# Altium project 4GLuxLogger.PrjPcb
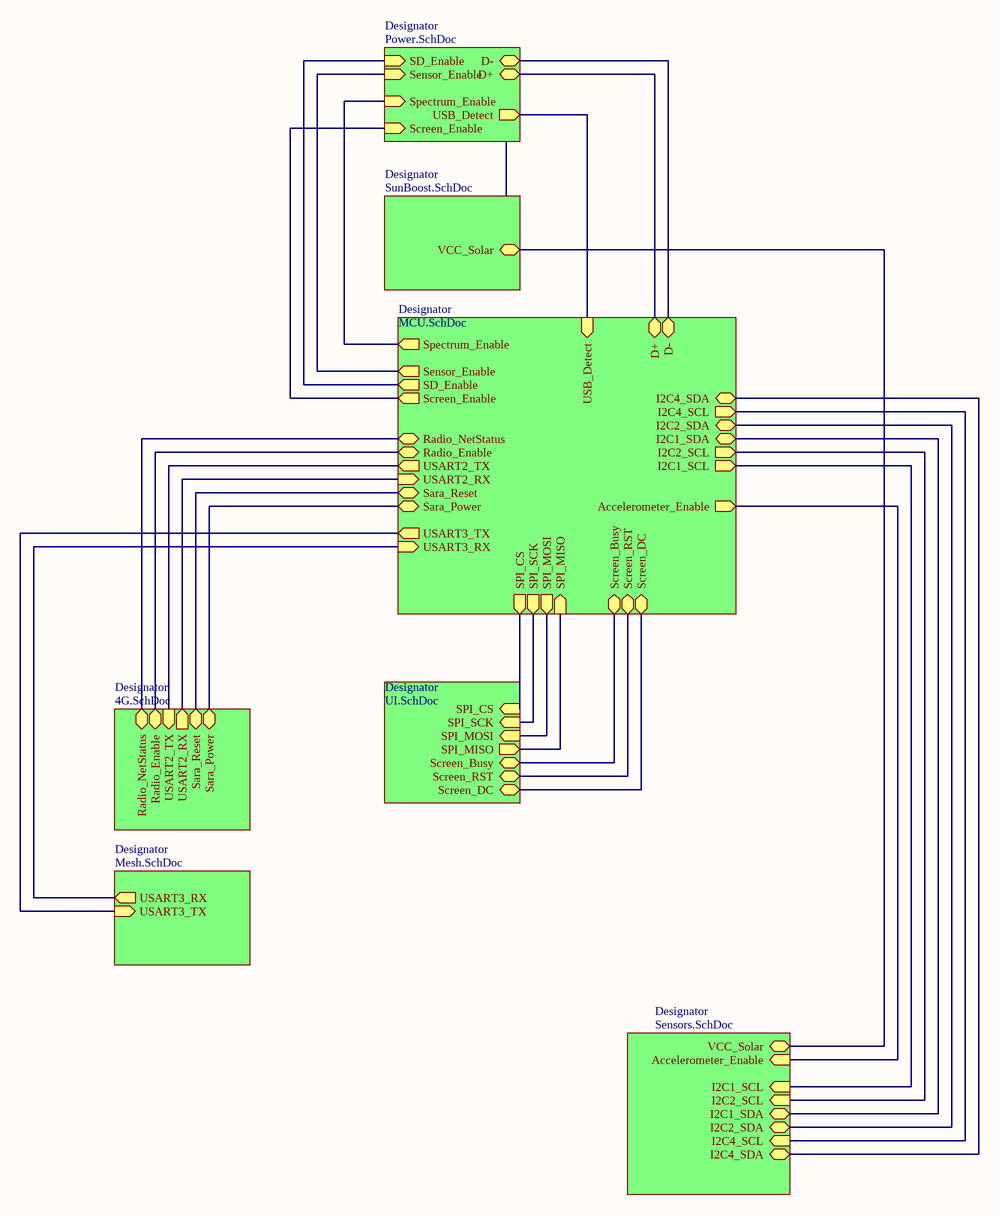
[diagram p0: OverView.SchDoc]
Project: 4GLX; Version: 1.0
7 sheets, 207 parts. Net scope: hierarchical (ports join the sheet entries above them; power ports are global).
Board files: 6C-4L-1550um.PcbDoc, 4GLL_V2.PcbDoc
Sheets:
  OverView.SchDoc
    Designator = MCU.SchDoc
    Designator = Sensors.SchDoc
    Designator = Power.SchDoc
    Designator = SunBoost.SchDoc
    Designator = 4G.SchDoc
    Designator = UI.SchDoc

## Sheet OverView.SchDoc
size A3; Organization: Altium Limited; Address1: L3, 12a Rodborough Rd; Address2: Frenchs Forest; Address3: NSW; Address4: Australia 2086

### Sub-sheets
Designator = MCU.SchDoc: Sensor_Enable (out), SD_Enable (out), SPI_CS (out), Radio_Enable (bidir), USART2_TX (out), SPI_SCK (out), USART3_RX (in), USART2_RX (in), USART3_TX (out), SPI_MISO (in), Radio_NetStatus (bidir), SPI_MOSI (out), Accelerometer_Enable (out), I2C1_SCL (out), I2C2_SCL (out), I2C1_SDA (bidir), I2C2_SDA (bidir), I2C4_SDA (bidir), I2C4_SCL (out), USB_Detect (in), Spectrum_Enable (out), Sara_Reset (bidir), Sara_Power (bidir), Screen_Enable (out), Screen_Busy (bidir), Screen_RST (bidir), Screen_DC (bidir), D- (bidir), D+ (bidir)
Designator = Sensors.SchDoc: VCC_Solar (bidir), Accelerometer_Enable (in), I2C1_SCL (in), I2C2_SCL (in), I2C1_SDA (bidir), I2C2_SDA (bidir), I2C4_SCL (in), I2C4_SDA (bidir)
Designator = Power.SchDoc: Sensor_Enable (in), SD_Enable (in), USB_Detect (out), Spectrum_Enable (in), Screen_Enable (in), D- (bidir), D+ (bidir)
Designator = SunBoost.SchDoc: VCC_Solar (bidir)
Designator = 4G.SchDoc: Radio_NetStatus (bidir), Radio_Enable (bidir), USART2_TX (in), USART2_RX (out), Sara_Reset (bidir), Sara_Power (bidir)
Designator = UI.SchDoc: SPI_CS (in), SPI_SCK (in), SPI_MOSI (in), SPI_MISO (out), Screen_Busy (bidir), Screen_DC (bidir), Screen_RST (bidir)
Designator = Mesh.SchDoc (file not in this document): USART3_TX (in), USART3_RX (out)

### Nets
Accelerometer_Enable: sheet Designator/Accelerometer_Enable, sheet Designator/Accelerometer_Enable
VCC: sheet Designator/VCC_Solar, sheet Designator/VCC_Solar
BUSY: sheet Designator/Screen_Busy, sheet Designator/Screen_Busy
CS: sheet Designator/SPI_CS, sheet Designator/SPI_CS
D/C: sheet Designator/Screen_DC, sheet Designator/Screen_DC
I2C1_SCL: sheet Designator/I2C1_SCL, sheet Designator/I2C1_SCL
I2C1_SDA: sheet Designator/I2C1_SDA, sheet Designator/I2C1_SDA
I2C2_SCL: sheet Designator/I2C2_SCL, sheet Designator/I2C2_SCL
I2C2_SDA: sheet Designator/I2C2_SDA, sheet Designator/I2C2_SDA
I2C4_SCL: sheet Designator/I2C4_SCL, sheet Designator/I2C4_SCL
I2C4_SDA: sheet Designator/I2C4_SDA, sheet Designator/I2C4_SDA
NetStatus_Out: sheet Designator/Radio_NetStatus, sheet Designator/Radio_NetStatus
Radio Enable: sheet Designator/Radio_Enable, sheet Designator/Radio_Enable
Sara_Power: sheet Designator/Sara_Power, sheet Designator/Sara_Power
Sara_Reset: sheet Designator/Sara_Reset, sheet Designator/Sara_Reset
Screen_Enable: sheet Designator/Screen_Enable, sheet Designator/Screen_Enable
Screen_RST: sheet Designator/Screen_RST, sheet Designator/Screen_RST
SD_Enable: sheet Designator/SD_Enable, sheet Designator/SD_Enable
Sensor_Enable: sheet Designator/Sensor_Enable, sheet Designator/Sensor_Enable
Spectrum_Enable: sheet Designator/Spectrum_Enable, sheet Designator/Spectrum_Enable
SPI_MISO: sheet Designator/SPI_MISO, sheet Designator/SPI_MISO
SPI_MOSI: sheet Designator/SPI_MOSI, sheet Designator/SPI_MOSI
SPI_SCK: sheet Designator/SPI_SCK, sheet Designator/SPI_SCK
USART2_RX: sheet Designator/USART2_RX, sheet Designator/USART2_RX
USART2_TX: sheet Designator/USART2_TX, sheet Designator/USART2_TX
USART3_RX: sheet Designator/USART3_RX, sheet Designator/USART3_RX
USART3_TX: sheet Designator/USART3_TX, sheet Designator/USART3_TX
USB_Detect: sheet Designator/USB_Detect, sheet Designator/USB_Detect
NetR22_1: sheet Designator/D-, sheet Designator/D-
NetR23_1: sheet Designator/D+, sheet Designator/D+

### Notes on the sheet
- Title
- Size:
- Date:
- A3
- Number:
- Time:
- Revision:
- Sheet
- of
- File:

## Sheet MCU.SchDoc
size A3; Organization: Altium Limited; Address1: L3, 12a Rodborough Rd; Address2: Frenchs Forest; Address3: NSW; Address4: Australia 2086
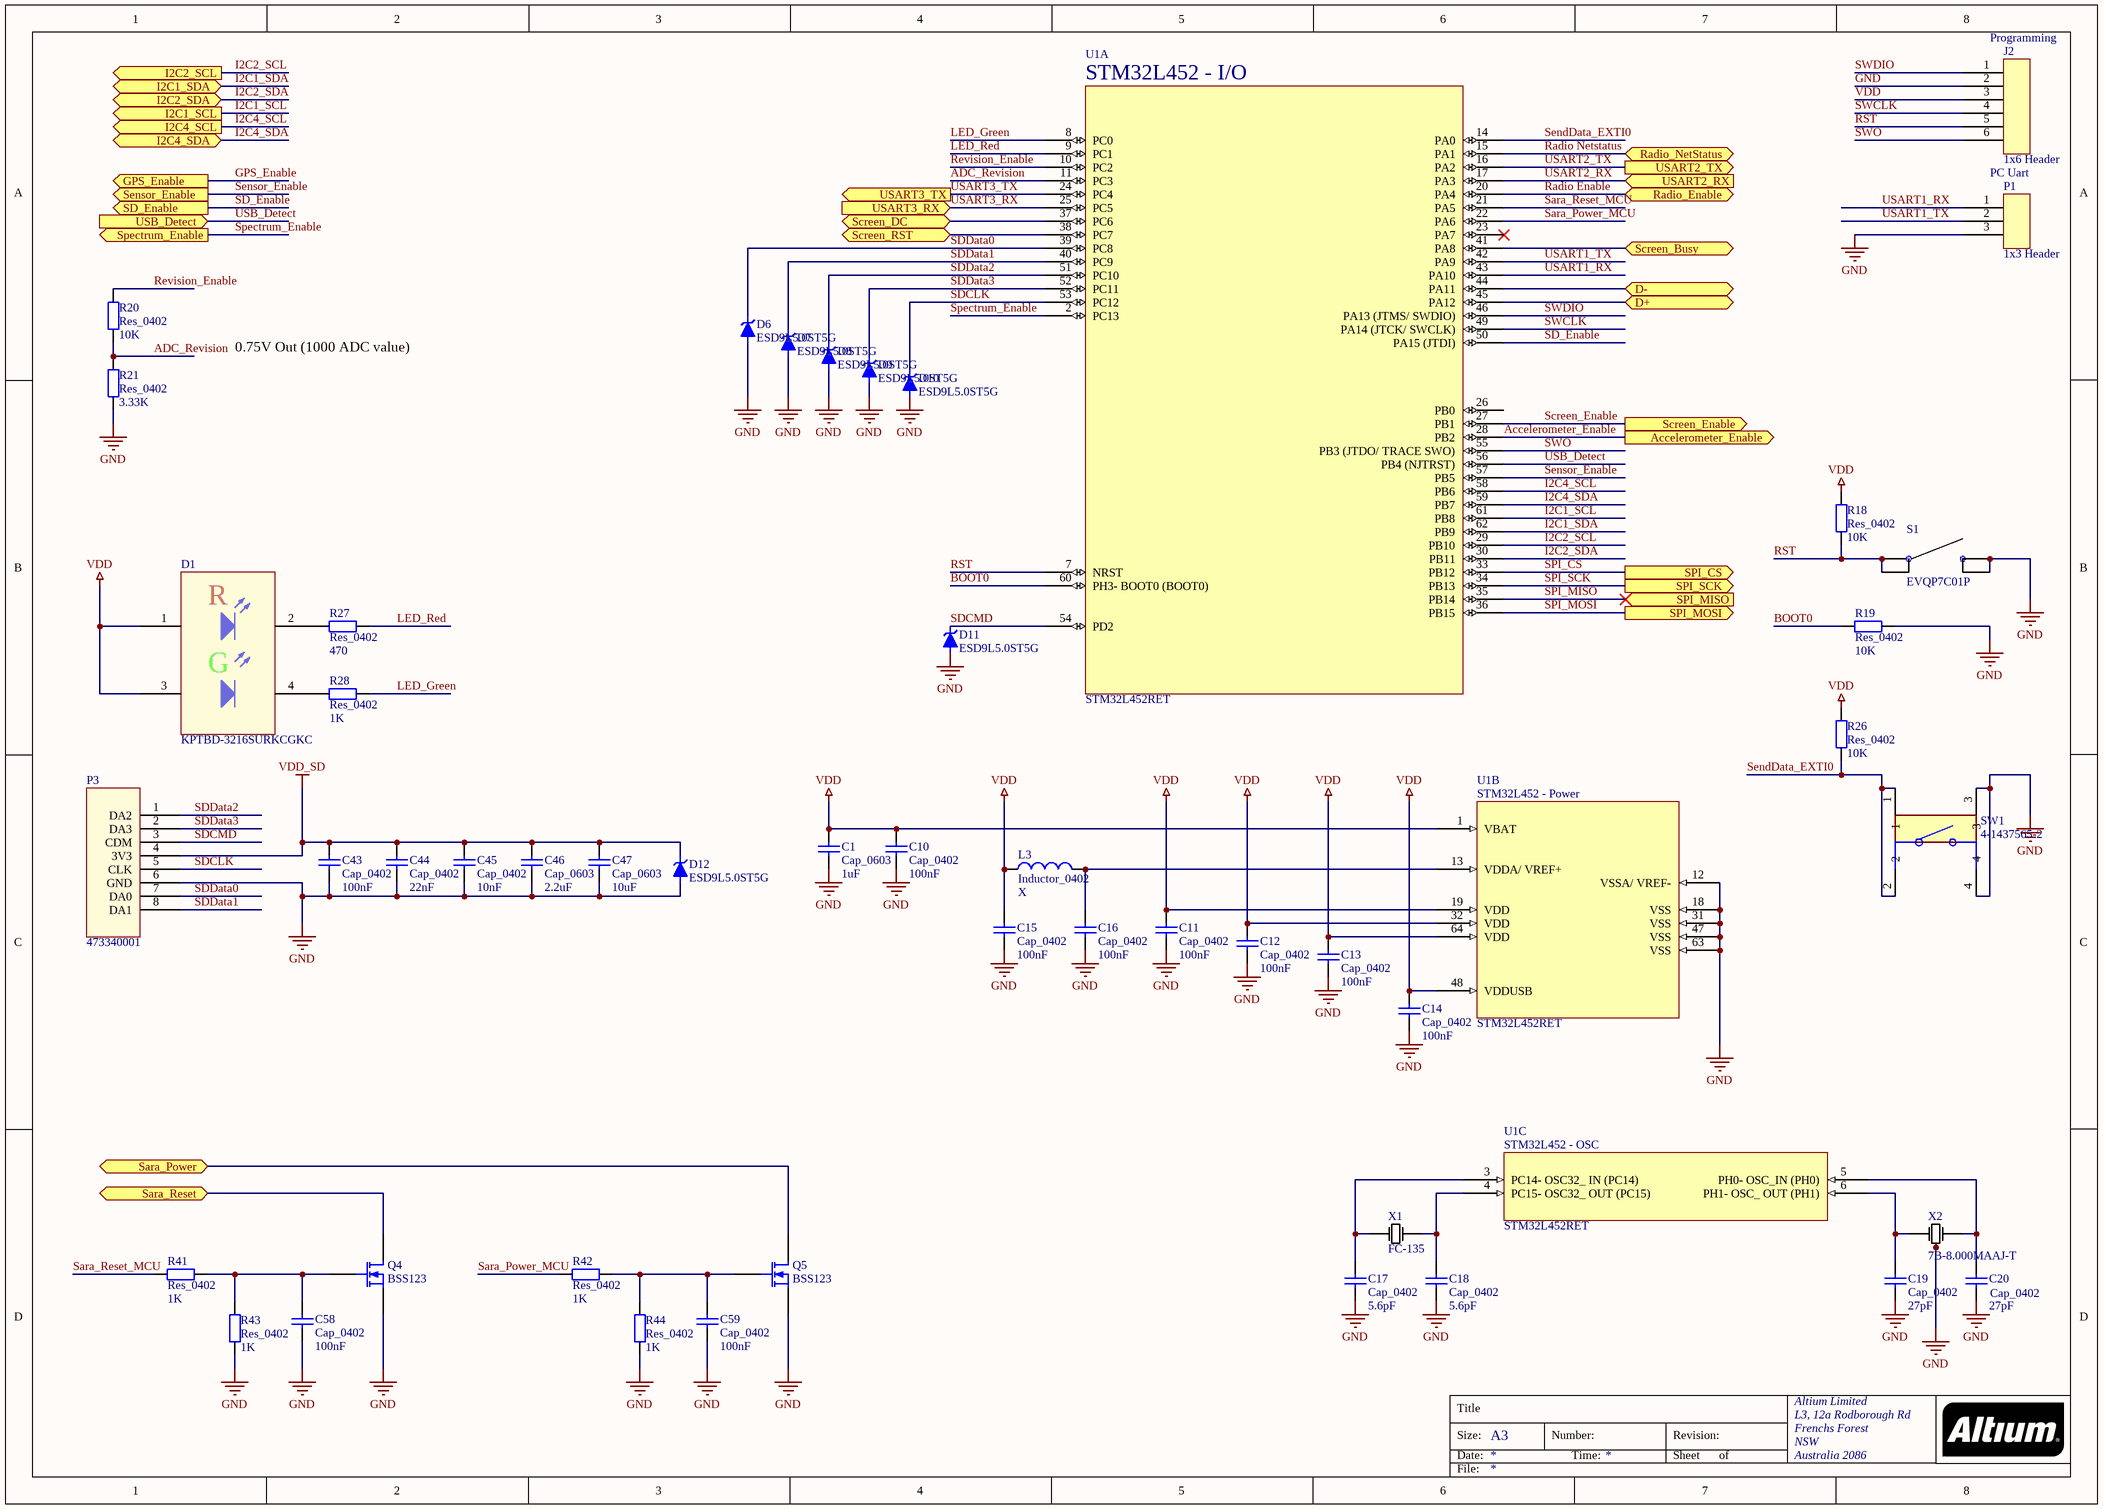
[diagram p1: MCU.SchDoc]

### Parts
(Parts that share a designator on the sheet are numbered #1, #2 ... from top to bottom, then left to right.)
C1  Cap_0603  value 1uF  [0603]
C10  Cap_0402  value 100nF  [0402]
C11  Cap_0402  value 100nF  [0402]
C12  Cap_0402  value 100nF  [0402]
C13  Cap_0402  value 100nF  [0402]
C14  Cap_0402  value 100nF  [0402]
C15  Cap_0402  value 100nF  [0402]
C16  Cap_0402  value 100nF  [0402]
C17  Cap_0402  value 5.6pF  [0402]
C18  Cap_0402  value 5.6pF  [0402]
C19  Cap_0402  value 27pF  [0402]
C20  Cap_0402  value 27pF  [0402]
C43  Cap_0402  value 100nF  [0402]
C44  Cap_0402  value 22nF  [0402]
C45  Cap_0402  value 10nF  [0402]
C46  Cap_0603  value 2.2uF  [0603]
C47  Cap_0603  value 10uF  [0603]
C58  Cap_0402  value 100nF  [0402]
C59  Cap_0402  value 100nF  [0402]
D1  KPTBD-3216SURKCGKC  [1206_DualLED]
D6  ESD9L5.0ST5G  [SODFL100X40-2N]
D7  ESD9L5.0ST5G  [SODFL100X40-2N]
D8  ESD9L5.0ST5G  [SODFL100X40-2N]
D9  ESD9L5.0ST5G  [SODFL100X40-2N]
D10  ESD9L5.0ST5G  [SODFL100X40-2N]
D11  ESD9L5.0ST5G  [SODFL100X40-2N]
D12  ESD9L5.0ST5G  [SODFL100X40-2N]
J2  1x6 Header  [1x6 Header 1.27]
L3  Inductor_0402  value X  [0402]
P1#1  1x3 Header  [1x3 Header 1.27]
P3  473340001  [473340001]
Q4  BSS123  [SOT-23]
Q5  BSS123  [SOT-23]
R18  Res_0402  value 10K  [0402]
R19  Res_0402  value 10K  [0402]
R20  Res_0402  value 10K  [0402]
R21  Res_0402  value 3.33K  [0402]
R26  Res_0402  value 10K  [0402]
R27  Res_0402  value 470  [0402]
R28  Res_0402  value 1K  [0402]
R41  Res_0402  value 1K  [0402]
R42  Res_0402  value 1K  [0402]
R43  Res_0402  value 1K  [0402]
R44  Res_0402  value 1K  [0402]
S1  EVQP7C01P  [EVQP7C]
SW1  4-1437565-2  [SW_4-1437565-2]
U1  STM32L452RET  [LQFP64]  (parts A,B,C of 3)
X1  FC-135  [FC-135]
X2  7B-8.000MAAJ-T  [Oscillator]

### Ports
Accelerometer_Enable (out), D+ (bidir), D- (bidir), GPS_Enable (out), I2C1_SCL (out), I2C1_SDA (bidir), I2C2_SCL (out), I2C2_SDA (bidir), I2C4_SCL (out), I2C4_SDA (bidir), Radio_Enable (bidir), Radio_NetStatus (bidir), Sara_Power (bidir), Sara_Reset (bidir), Screen_Busy (bidir), Screen_DC (bidir), Screen_Enable (out), Screen_RST (bidir), SD_Enable (out), Sensor_Enable (out), Spectrum_Enable (out), SPI_CS (out), SPI_MISO (in), SPI_MOSI (out), SPI_SCK (out), USART2_RX (in), USART2_TX (out), USART3_RX (in), USART3_TX (out), USB_Detect (in)

### Nets
Accelerometer_Enable: U1.28(PB2) ; port Accelerometer_Enable
GND: C1.1 C10.1 C11.1 C12.1 C13.1 C14.1 C15.1 C16.1 C17.1 C18.1 C19.1 C20.1 C43.1 C44.1 C45.1 C46.1 C47.1 C58.1 C59.1 D6.2 D7.2 D8.2 D9.2 D10.2 D11.2 D12.2 J2.2 P1#1.3 P3.6(GND) Q4.2(S) Q5.2(S) R19.2 R21.1 R43.1 R44.1 S1.3 S1.4 SW1.3 SW1.4 U1.12(VSSA/_VREF-) U1.18(VSS) U1.31(VSS) U1.47(VSS) U1.63(VSS) X2.2 X2.4
VDD: C1.2 C10.2 C11.2 C12.2 C13.2 C14.2 C15.2 D1.1 D1.3 J2.3 L3.1 R18.2 R26.2 U1.1(VBAT) U1.19(VDD) U1.32(VDD) U1.48(VDDUSB) U1.64(VDD)
VDD_SD: C43.2 C44.2 C45.2 C46.2 C47.2 D12.1 P3.4(3V3)
ADC_Revision: R20.1 R21.2 U1.11(PC3)
BOOT0: R19.1 U1.60(PH3-_BOOT0_(BOOT0))
BUSY: U1.41(PA8) ; port Screen_Busy
D/C: U1.37(PC6) ; port Screen_DC
GPS_Enable: port GPS_Enable
I2C1_SCL: U1.61(PB8) ; port I2C1_SCL
I2C1_SDA: U1.62(PB9) ; port I2C1_SDA
I2C2_SCL: U1.29(PB10) ; port I2C2_SCL
I2C2_SDA: U1.30(PB11) ; port I2C2_SDA
I2C4_SCL: U1.58(PB6) ; port I2C4_SCL
I2C4_SDA: U1.59(PB7) ; port I2C4_SDA
LED_Green: R28.1 U1.8(PC0)
LED_Red: R27.1 U1.9(PC1)
Radio Enable: U1.20(PA4) ; port Radio_Enable
Radio Netstatus: U1.15(PA1) ; port Radio_NetStatus  [project net NetStatus_Out]
Revision_Enable: R20.2 U1.10(PC2)
RST: J2.5 R18.1 S1.1 S1.2 U1.7(NRST)
Sara_Power: Q5.3(D) ; port Sara_Power
Sara_Power_MCU: R42.1 U1.22(PA6)
Sara_Reset: Q4.3(D) ; port Sara_Reset
Sara_Reset_MCU: R41.1 U1.21(PA5)
Screen_Enable: U1.27(PB1) ; port Screen_Enable
Screen_RST: U1.38(PC7) ; port Screen_RST
SD_Enable: U1.50(PA15_(JTDI)) ; port SD_Enable
SDCLK: D10.1 P3.5(CLK) U1.53(PC12)
SDCMD: D11.1 P3.3(CDM) U1.54(PD2)
SDData0: D6.1 P3.7(DA0) U1.39(PC8)
SDData1: D7.1 P3.8(DA1) U1.40(PC9)
SDData2: D8.1 P3.1(DA2) U1.51(PC10)
SDData3: D9.1 P3.2(DA3) U1.52(PC11)
SendData_EXTI0: R26.1 SW1.1 SW1.2 U1.14(PA0)
Sensor_Enable: U1.57(PB5) ; port Sensor_Enable
Spectrum_Enable: U1.2(PC13) ; port Spectrum_Enable
SPI_CS: U1.33(PB12) ; port SPI_CS  [project net CS]
SPI_MISO: U1.35(PB14) ; port SPI_MISO
SPI_MOSI: U1.36(PB15) ; port SPI_MOSI
SPI_SCK: U1.34(PB13) ; port SPI_SCK
SWCLK: J2.4 U1.49(PA14_(JTCK/_SWCLK))
SWDIO: J2.1 U1.46(PA13_(JTMS/_SWDIO))
SWO: J2.6 U1.55(PB3_(JTDO/_TRACE_SWO))
USART1_RX: P1#1.1 U1.43(PA10)
USART1_TX: P1#1.2 U1.42(PA9)
USART2_RX: U1.17(PA3) ; port USART2_RX
USART2_TX: U1.16(PA2) ; port USART2_TX
USART3_RX: U1.25(PC5) ; port USART3_RX
USART3_TX: U1.24(PC4) ; port USART3_TX
USB_Detect: U1.56(PB4_(NJTRST)) ; port USB_Detect
NetC16_2: C16.2 L3.2 U1.13(VDDA/_VREF+)
NetC17_2: C17.2 U1.3(PC14-_OSC32__IN_(PC14)) X1.1
NetC18_2: C18.2 U1.4(PC15-_OSC32__OUT_(PC15)) X1.2
NetC19_2: C19.2 U1.6(PH1-_OSC__OUT_(PH1)) X2.1
NetC20_2: C20.2 U1.5(PH0-_OSC_IN_(PH0)) X2.3
NetC58_2: C58.2 Q4.1(G) R41.2 R43.2
NetC59_2: C59.2 Q5.1(G) R42.2 R44.2
NetD1_2: D1.2 R27.2
NetD1_4: D1.4 R28.2
NetR22_1: U1.44(PA11) ; port D-
NetR23_1: U1.45(PA12) ; port D+

Not connected (* = marked no-connect by the designer): U1 23(PA7)* 26(PB0)

### Notes on the sheet
- (near J2) Programming
- PC Uart
- 0.75V Out (1000 ADC value)
- Title
- Size:
- Date:
- A3
- Number:
- Time:
- Revision:
- Sheet
- of
- File:
- (in symbol KPTBD-3216SURKCGKC) R; G
- (in symbol STM32L452RET, part A) STM32L452 - I/O
- (in symbol STM32L452RET, part B) STM32L452 - Power
- (in symbol STM32L452RET, part C) STM32L452 - OSC

### Library data of the parts
C1 C46 C47 = Cap_0603: Capacitor; Published: 8-Jun-2000; LatestRevisionDate: 17-Jul-2002; LatestRevisionNote: Re-released for DXP Platform.; PackageReference: RAD-0.3; Publisher: Altium Limited; PackageDescription: Radial Cap, Thru-Hole; 2 Leads; 0.3 in Pin Spacing
C10-C20 C43-C45 C58 C59 = Cap_0402: Capacitor; Published: 8-Jun-2000; LatestRevisionDate: 17-Jul-2002; LatestRevisionNote: Re-released for DXP Platform.; PackageReference: RAD-0.3; Publisher: Altium Limited; PackageDescription: Radial Cap, Thru-Hole; 2 Leads; 0.3 in Pin Spacing
D1 = KPTBD-3216SURKCGKC: Dual Led Red/Green; Published: 8-Jun-2000; LatestRevisionDate: 08-Jul-2005; LatestRevisionNote: Mech Layer 1 removed.; PackageReference: LED-0; Publisher: Altium Limited; PackageDescription: LED; 2 Leads
D6-D12 = ESD9L5-0ST5G: TVS_ESD9L5-0ST5G
L3 = Inductor_0402: Inductor
P3 = SD Micro Card Holder
Q4 Q5 = BSS123: N-Channel MOSFET; Published: 8-Jun-2000; LatestRevisionDate: 17-Jul-2002; LatestRevisionNote: Re-released for DXP Platform.; PackageVersion: 1995/1996; PackageReference: E3; Publisher: Altium Limited; PackageDescription: TO, Flat Index; 3 In-Line, Axial Leads; Body Dia. 4.6mm; Lead Dia. 0.5 mm (max)
R18-R21 R26-R28 R41-R44 = Res_0402: Resistor; Published: 8-Jun-2000; LatestRevisionDate: 17-Jul-2002; LatestRevisionNote: Re-released for DXP Platform.; PackageReference: AXIAL-0.4; Publisher: Altium Limited; PackageDescription: Axial Device, Thru-Hole; 2 Leads; 0.4 in Pin Spacing
S1 = EVQP7C01P: EVQP7C01P Switch
SW1 = 4-1437565-2: Switch Tactile OFF (ON) SPST Round Button Gull Wing 0.05A 12VDC 1.57N SMD T/R; MF: {'manufacturer': u'TE Connectivity'}; Price: None; Value: *; Availability: Unavailable; Package: None; MP: 4-1437565-2
U1 = STM32L452RET: MCU; Man. Part no: STM32L452RET6; Digikey no: 497-17219-ND; Farnell no: 2758810
X1 = Oscillator 32.768KHz
X2 = Oscillator 8MHz

## Sheet Sensors.SchDoc
size A3; Organization: Altium Limited; Address1: L3, 12a Rodborough Rd; Address2: Frenchs Forest; Address3: NSW; Address4: Australia 2086
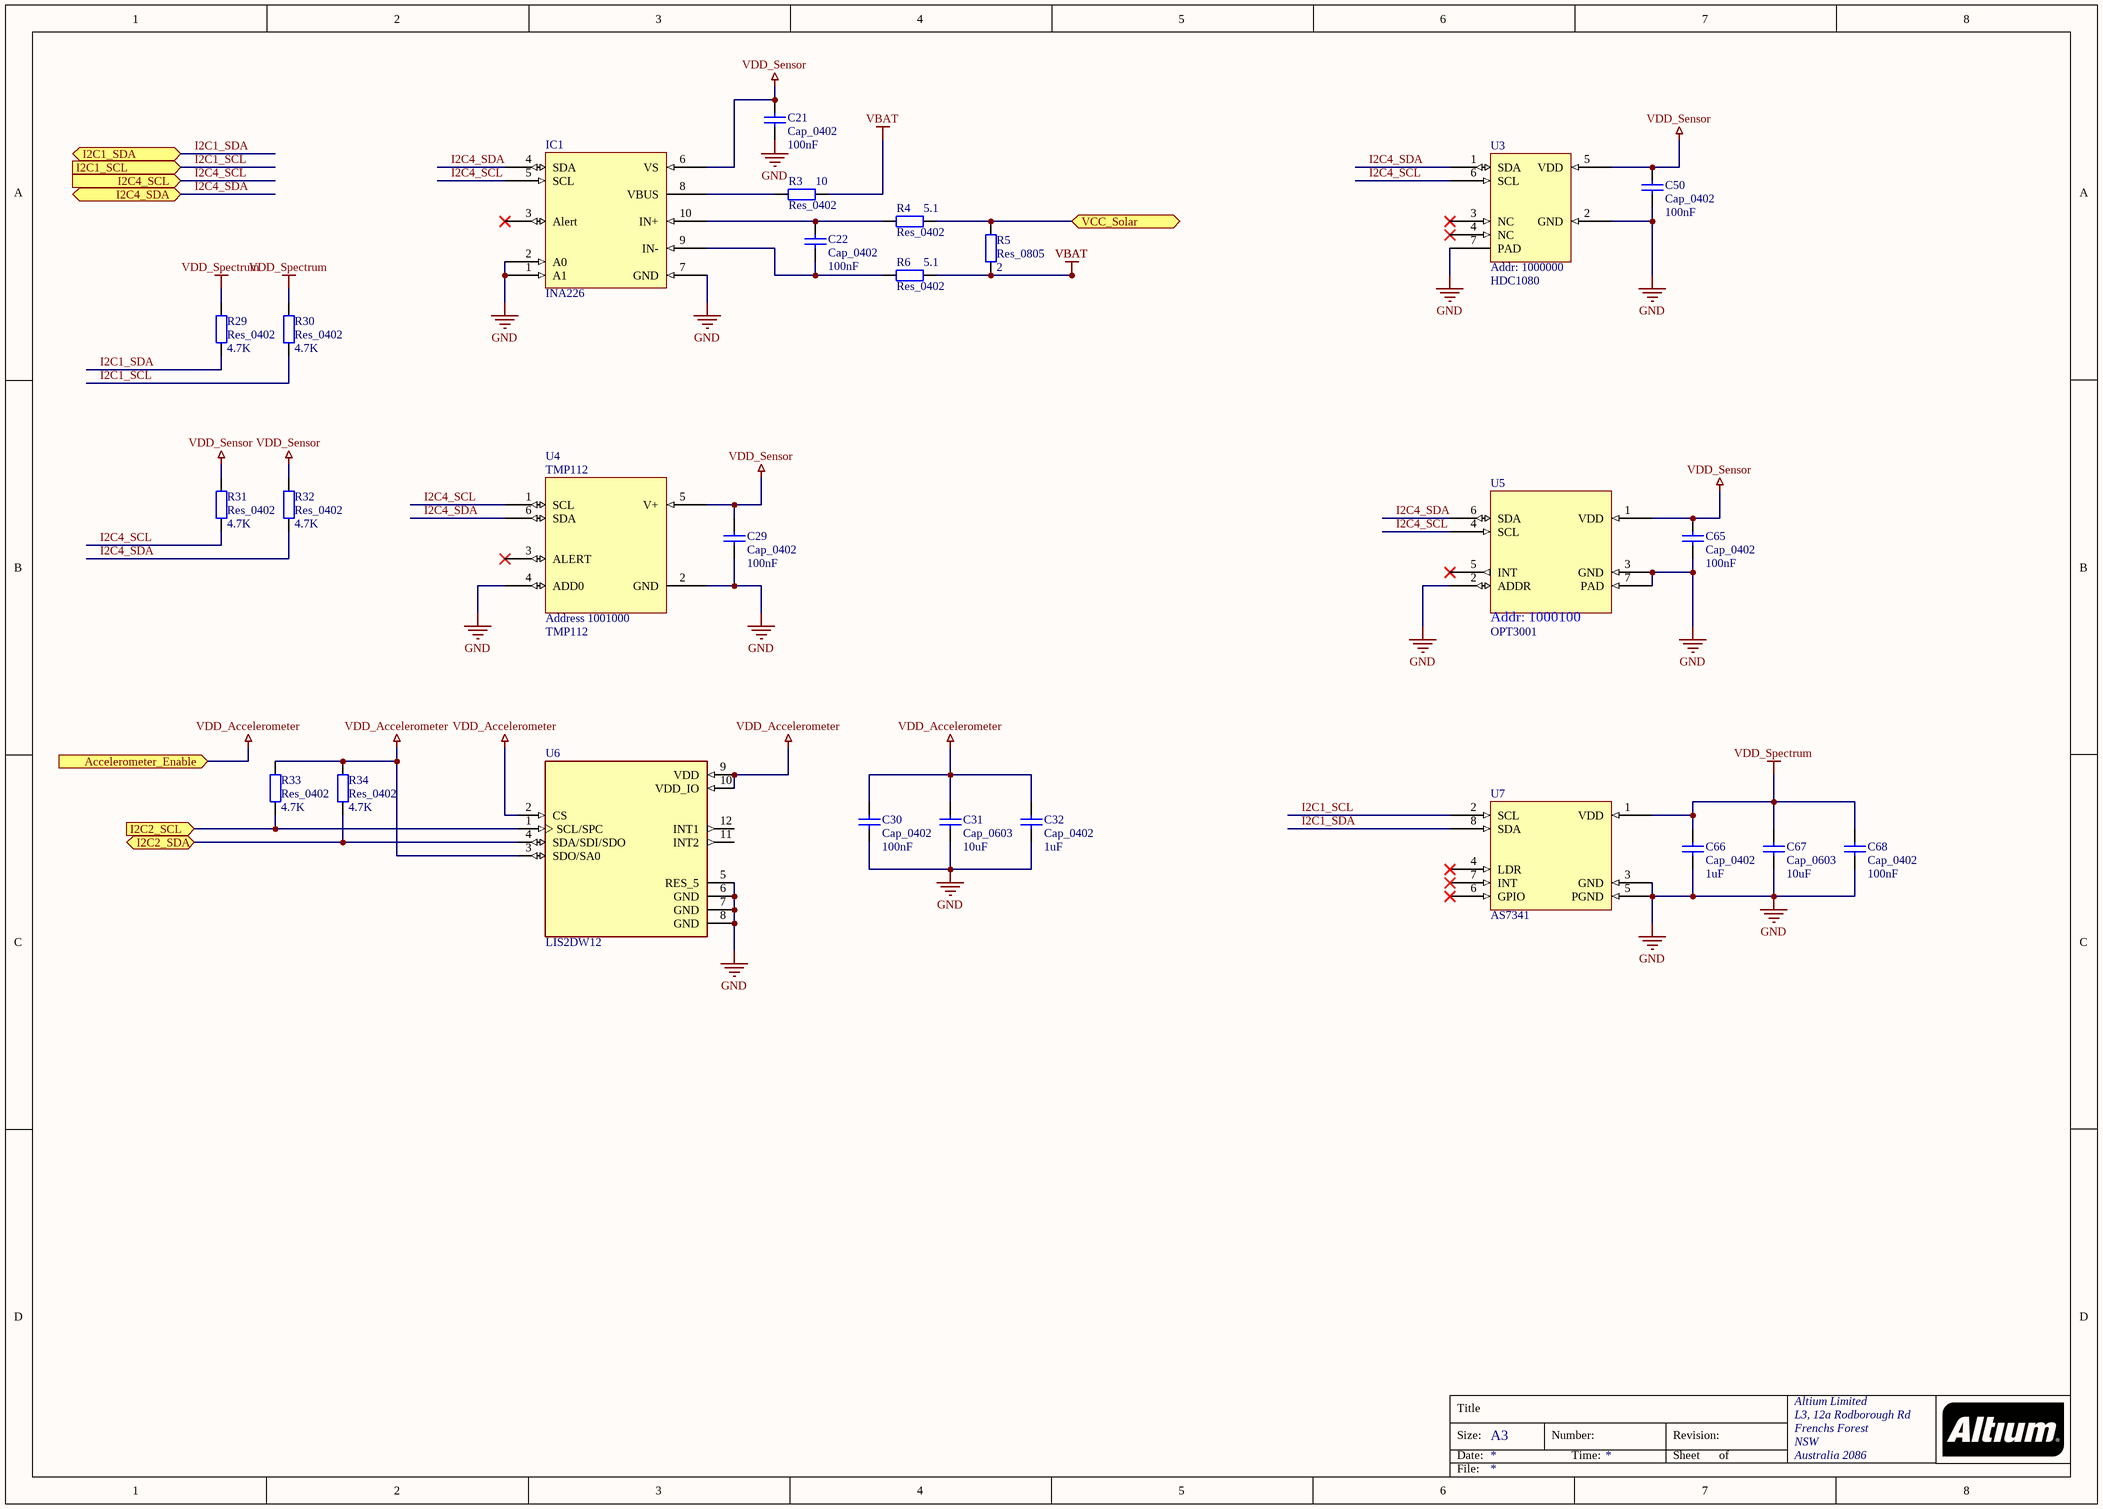
[diagram p2: Sensors.SchDoc]

### Parts
C21  Cap_0402  value 100nF  [0402]
C22  Cap_0402  value 100nF  [0402]
C29  Cap_0402  value 100nF  [0402]
C30  Cap_0402  value 100nF  [0402]
C31  Cap_0603  value 10uF  [0603]
C32  Cap_0402  value 1uF  [0402]
C50  Cap_0402  value 100nF  [0402]
C65  Cap_0402  value 100nF  [0402]
C66  Cap_0402  value 1uF  [0402]
C67  Cap_0603  value 10uF  [0603]
C68  Cap_0402  value 100nF  [0402]
IC1  INA226  [VSSOP-10]
R3  Res_0402  value 10  [0402]
R4  Res_0402  value 5.1  [0402]
R5  Res_0805  value 2  [0805]
R6  Res_0402  value 5.1  [0402]
R29  Res_0402  value 4.7K  [0402]
R30  Res_0402  value 4.7K  [0402]
R31  Res_0402  value 4.7K  [0402]
R32  Res_0402  value 4.7K  [0402]
R33  Res_0402  value 4.7K  [0402]
R34  Res_0402  value 4.7K  [0402]
U3  HDC1080  [PSON95P300X80_HS]
U4  TMP112  [SOT563 (6)]
U5  OPT3001  [USON-6]
U6  LIS2DW12  [LGA-12]
U7  AS7341  [OLGA-8]

### Ports
Accelerometer_Enable (in), I2C1_SCL (in), I2C1_SDA (bidir), I2C2_SCL (in), I2C2_SDA (bidir), I2C4_SCL (in), I2C4_SDA (bidir), VCC_Solar (bidir)

### Nets
GND: C21.1 C29.1 C30.1 C31.1 C32.1 C50.1 C65.1 C66.1 C67.1 C68.1 IC1.1(A1) IC1.2(A0) IC1.7(GND) U3.2(GND) U3.7(PAD) U4.2(GND) U4.4(ADD0) U5.2(ADDR) U5.3(GND) U5.7(PAD) U6.5(RES_5) U6.6(GND) U6.7(GND) U6.8(GND) U7.3(GND) U7.5(PGND)
VBAT: R3.2 R5.1 R6.2
VCC: R4.2 R5.2 ; port VCC_Solar
VDD_Accelerometer: C30.2 C31.2 C32.2 R33.2 R34.2 U6.2(CS) U6.3(SDO/SA0) U6.9(VDD) U6.10(VDD_IO) ; port Accelerometer_Enable  [project net Accelerometer_Enable]
VDD_Sensor: C21.2 C29.2 C50.2 C65.2 IC1.6(VS) R31.2 R32.2 U3.5(VDD) U4.5(V+) U5.1(VDD)
VDD_Spectrum: C66.2 C67.2 C68.2 R29.2 R30.2 U7.1(VDD)
I2C1_SCL: R30.1 U7.2(SCL) ; port I2C1_SCL
I2C1_SDA: R29.1 U7.8(SDA) ; port I2C1_SDA
I2C2_SCL: R33.1 U6.1(SCL/SPC) ; port I2C2_SCL
I2C2_SDA: R34.1 U6.4(SDA/SDI/SDO) ; port I2C2_SDA
I2C4_SCL: IC1.5(SCL) R31.1 U3.6(SCL) U4.1(SCL) U5.4(SCL) ; port I2C4_SCL
I2C4_SDA: IC1.4(SDA) R32.1 U3.1(SDA) U4.6(SDA) U5.6(SDA) ; port I2C4_SDA
NetC22_1: C22.1 IC1.9(IN-) R6.1
NetC22_2: C22.2 IC1.10(IN+) R4.1
NetIC1_8: IC1.8(VBUS) R3.1

Not connected (* = marked no-connect by the designer): IC1 3(Alert)*; U3 3(NC)* 4(NC)*; U4 3(ALERT)*; U5 5(INT)*; U6 11(INT2) 12(INT1); U7 4(LDR)* 6(GPIO)* 7(INT)*

### Notes on the sheet
- Title
- Size:
- Date:
- A3
- Number:
- Time:
- Revision:
- Sheet
- of
- File:
- (in symbol HDC1080) Addr: 1000000
- (in symbol OPT3001) Addr: 1000100
- (in symbol TMP112) Address 1001000

### Library data of the parts
C21 C22 C29 C30 C32 C50 C65 C66 C68 = Cap_0402: Capacitor; Published: 8-Jun-2000; LatestRevisionDate: 17-Jul-2002; LatestRevisionNote: Re-released for DXP Platform.; PackageReference: RAD-0.3; Publisher: Altium Limited; PackageDescription: Radial Cap, Thru-Hole; 2 Leads; 0.3 in Pin Spacing
C31 C67 = Cap_0603: Capacitor; Published: 8-Jun-2000; LatestRevisionDate: 17-Jul-2002; LatestRevisionNote: Re-released for DXP Platform.; PackageReference: RAD-0.3; Publisher: Altium Limited; PackageDescription: Radial Cap, Thru-Hole; 2 Leads; 0.3 in Pin Spacing
IC1 = INA226: Bi-Directional Current and Power Monitor
R3 R4 R6 R29-R34 = Res_0402: Resistor; Published: 8-Jun-2000; LatestRevisionDate: 17-Jul-2002; LatestRevisionNote: Re-released for DXP Platform.; PackageReference: AXIAL-0.4; Publisher: Altium Limited; PackageDescription: Axial Device, Thru-Hole; 2 Leads; 0.4 in Pin Spacing
R5 = Res_0805: Resistor; Published: 8-Jun-2000; LatestRevisionDate: 17-Jul-2002; LatestRevisionNote: Re-released for DXP Platform.; PackageReference: AXIAL-0.4; Publisher: Altium Limited; PackageDescription: Axial Device, Thru-Hole; 2 Leads; 0.4 in Pin Spacing
U3 = HDC1080: Humidity Sensor
U4 = TMP112: Temperature measurement unit; Man. Part no.: TMP112AIDRLR; Digikey no.: 296-38578-1-ND; Farnell no.: 3009067
U5 = OPT3001: Lux sensor
U6 = LIS2DW12: Accelerometer X, Y, Z Axis Â±2g, 4g, 8g, 16g 0.5Hz ~ 672Hz 12-LGA _2x2_; MF: STMicroelectronics; MP: LIS2DH12; SnapEDA_Link: https://www.snapeda.com/parts/LIS2DH12/STMicroelectronics/view-part/480350/?ref=snap; Package: LGA-12 STMicroelectronics; Price: None; Value: *; Availability: Unavailable
U7 = AS7341: Spectrum Sensor

## Sheet Power.SchDoc
size A3; Organization: Altium Limited; Address1: L3, 12a Rodborough Rd; Address2: Frenchs Forest; Address3: NSW; Address4: Australia 2086
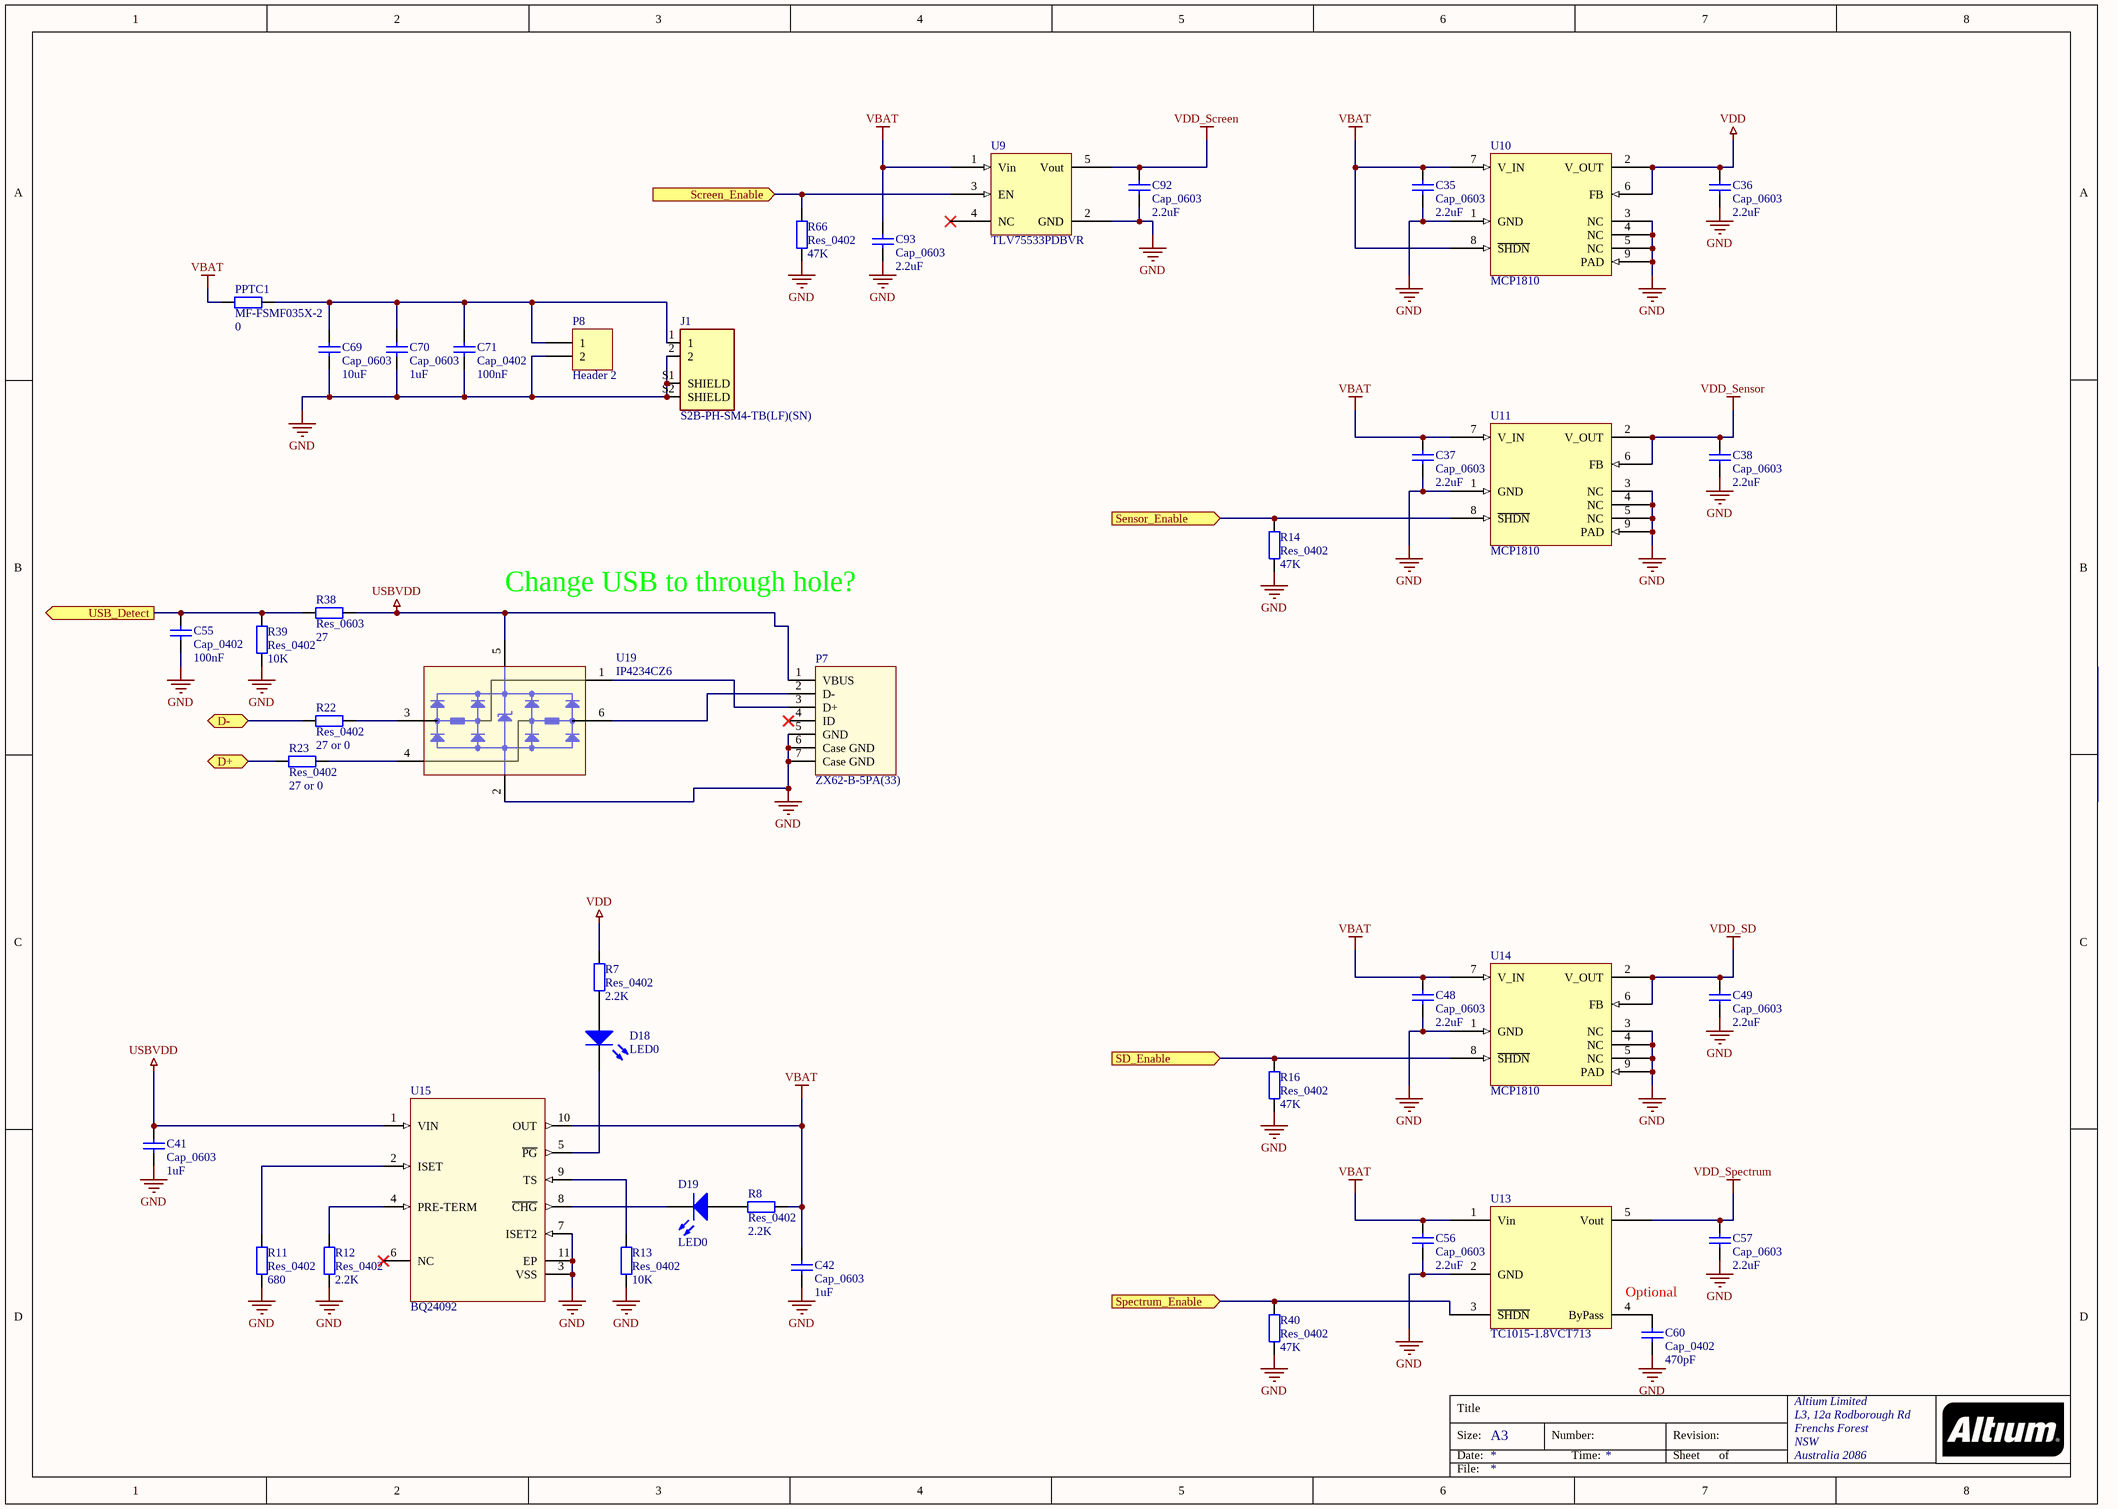
[diagram p3: Power.SchDoc]

### Parts
C35  Cap_0603  value 2.2uF  [0603]
C36  Cap_0603  value 2.2uF  [0603]
C37  Cap_0603  value 2.2uF  [0603]
C38  Cap_0603  value 2.2uF  [0603]
C41  Cap_0603  value 1uF  [0603]
C42  Cap_0603  value 1uF  [0603]
C48  Cap_0603  value 2.2uF  [0603]
C49  Cap_0603  value 2.2uF  [0603]
C55  Cap_0402  value 100nF  [0402]
C56  Cap_0603  value 2.2uF  [0603]
C57  Cap_0603  value 2.2uF  [0603]
C60  Cap_0402  value 470pF  [0402]
C69  Cap_0603  value 10uF  [0603]
C70  Cap_0603  value 1uF  [0603]
C71  Cap_0402  value 100nF  [0402]
C92  Cap_0603  value 2.2uF  [0603]
C93  Cap_0603  value 2.2uF  [0603]
D18  LED0  [0603]
D19  LED0  [0603]
J1  S2B-PH-SM4-TB(LF)(SN)  [JST_S2B-PH-SM4-TB(LF)(SN)]
P7  ZX62-B-5PA(33)  [ZX62-B-5PA(33)]
P8  Header 2  [HDR1X2]
PPTC1  MF-FSMF035X-2  value 0  [0603]
R7  Res_0402  value 2.2K  [0402]
R8  Res_0402  value 2.2K  [0402]
R11  Res_0402  value 680  [0402]
R12  Res_0402  value 2.2K  [0402]
R13  Res_0402  value 10K  [0402]
R14  Res_0402  value 47K  [0402]
R16  Res_0402  value 47K  [0402]
R22  Res_0402  value 27 or 0  [0402]
R23  Res_0402  value 27 or 0  [0402]
R38  Res_0603  value 27  [0603]
R39  Res_0402  value 10K  [0402]
R40  Res_0402  value 47K  [0402]
R66  Res_0402  value 47K  [0402]
U9  TLV75533PDBVR  [SOT-23 (5)]
U10  MCP1810  [VDFN8]
U11  MCP1810  [VDFN8]
U13  TC1015-1.8VCT713  [SOT-23 (5)]
U14  MCP1810  [VDFN8]
U15  BQ24092  [HVSSOP-10]
U19  IP4234CZ6  [TSOP95P280X110_HS-7N]

### Ports
D+ (bidir), D- (bidir), Screen_Enable (in), SD_Enable (in), Sensor_Enable (in), Spectrum_Enable (in), USB_Detect (out)

### Nets
GND: C35.1 C36.1 C37.1 C38.1 C41.1 C42.1 C48.1 C49.1 C55.1 C56.1 C57.1 C60.1 C69.1 C70.1 C71.1 C92.1 C93.1 J1.2 J1.S1(SHIELD) J1.S2(SHIELD) P7.5(GND) P7.6(Case_GND) P7.7(Case_GND) P8.2 R11.1 R12.1 R13.1 R14.2 R16.1 R39.1 R40.2 R66.2 U9.2(GND) U10.1(GND) U10.3(NC) U10.4(NC) U10.5(NC) U10.9(PAD) U11.1(GND) U11.3(NC) U11.4(NC) U11.5(NC) U11.9(PAD) U13.2(GND) U14.1(GND) U14.3(NC) U14.4(NC) U14.5(NC) U14.9(PAD) U15.3(VSS) U15.7(ISET2) U15.11(EP) U19.2(GND)
USBVDD: C41.2 P7.1(VBUS) R38.2 U15.1(VIN) U19.5(VCC)
VBAT: C35.2 C37.2 C42.2 C48.2 C56.2 C93.2 PPTC1.1 R8.1 U9.1(Vin) U10.7(V_IN) U10.8(~{SHDN}) U11.7(V_IN) U13.1(Vin) U14.7(V_IN) U15.10(OUT)
VDD: C36.2 R7.2 U10.2(V_OUT) U10.6(FB)
VDD_Screen: C92.2 U9.5(Vout)
VDD_SD: C49.2 U14.2(V_OUT) U14.6(FB)
VDD_Sensor: C38.2 U11.2(V_OUT) U11.6(FB)
VDD_Spectrum: C57.2 U13.5(Vout)
Screen_Enable: R66.1 U9.3(EN) ; port Screen_Enable
SD_Enable: R16.2 U14.8(~{SHDN}) ; port SD_Enable
Sensor_Enable: R14.1 U11.8(~{SHDN}) ; port Sensor_Enable
Spectrum_Enable: R40.1 U13.3(~{SHDN}) ; port Spectrum_Enable
USB_Detect: C55.2 R38.1 R39.2 ; port USB_Detect
NetC60_2: C60.2 U13.4(ByPass)
NetC69_2: C69.2 C70.2 C71.2 J1.1 P8.1 PPTC1.2
NetD18_1: D18.1(K) U15.5(~{PG})
NetD18_2: D18.2(A) R7.1
NetD19_1: D19.1(K) U15.8(~{CHG})
NetD19_2: D19.2(A) R8.2
NetP7_2: P7.2(D-) U19.6(CH2_B)
NetP7_3: P7.3(D+) U19.1(CH1_A)
NetR11_2: R11.2 U15.2(ISET)
NetR12_2: R12.2 U15.4(PRE-TERM)
NetR13_2: R13.2 U15.9(TS)
NetR22_1: R22.1 ; port D-
NetR22_2: R22.2 U19.3(CH1_B)
NetR23_1: R23.1 ; port D+
NetR23_2: R23.2 U19.4(CH2_A)

Not connected (* = marked no-connect by the designer): P7 4(ID)*; U9 4(NC)*; U15 6(NC)*

### Notes on the sheet
- Change USB to through hole?
- (near U13) Optional
- Title
- Size:
- Date:
- A3
- Number:
- Time:
- Revision:
- Sheet
- of
- File:

### Library data of the parts
C35-C38 C41 C42 C48 C49 C56 C57 C69 C70 C92 C93 = Cap_0603: Capacitor; Published: 8-Jun-2000; LatestRevisionDate: 17-Jul-2002; LatestRevisionNote: Re-released for DXP Platform.; PackageReference: RAD-0.3; Publisher: Altium Limited; PackageDescription: Radial Cap, Thru-Hole; 2 Leads; 0.3 in Pin Spacing
C55 C60 C71 = Cap_0402: Capacitor; Published: 8-Jun-2000; LatestRevisionDate: 17-Jul-2002; LatestRevisionNote: Re-released for DXP Platform.; PackageReference: RAD-0.3; Publisher: Altium Limited; PackageDescription: Radial Cap, Thru-Hole; 2 Leads; 0.3 in Pin Spacing
D18 D19 = LED0: Typical INFRARED GaAs LED; Published: 8-Jun-2000; LatestRevisionDate: 08-Jul-2005; LatestRevisionNote: Mech Layer 1 removed.; PackageReference: LED-0; Publisher: Altium Limited; PackageDescription: LED; 2 Leads
J1 = S2B-PH-SM4-TB(LF)(SN): PH Series 2 Position 2 mm Pitch Surface Mount Side Entry Shrouded Header; MF: {'manufacturer': u'JST Sales'}; MP: S2B-PH-SM4-TB(LF)(SN); Availability: Unavailable; Package: None; Price: None; Value: *
P7 = ZX62-B-5PA(33): USB Connector
P8 = Header 2: Header, 2-Pin; LatestRevisionDate: 17-Jul-2002; LatestRevisionNote: Re-released for DXP Platform.; Publisher: Altium Limited
PPTC1 = MF-FSMF035X-2: PPTC_0603; Published: 8-Jun-2000; LatestRevisionDate: 17-Jul-2002; LatestRevisionNote: Re-released for DXP Platform.; PackageReference: AXIAL-0.4; Publisher: Altium Limited; PackageDescription: Axial Device, Thru-Hole; 2 Leads; 0.4 in Pin Spacing
R7 R8 R11-R14 R16 R22 R23 R39 R40 R66 = Res_0402: Resistor; Published: 8-Jun-2000; LatestRevisionDate: 17-Jul-2002; LatestRevisionNote: Re-released for DXP Platform.; PackageReference: AXIAL-0.4; Publisher: Altium Limited; PackageDescription: Axial Device, Thru-Hole; 2 Leads; 0.4 in Pin Spacing
R38 = Res_0603: Resistor; Published: 8-Jun-2000; LatestRevisionDate: 17-Jul-2002; LatestRevisionNote: Re-released for DXP Platform.; PackageReference: AXIAL-0.4; Publisher: Altium Limited; PackageDescription: Axial Device, Thru-Hole; 2 Leads; 0.4 in Pin Spacing
U9 = TLV75533PDBVR: 3.3V regulator
U10 U11 U14 = MCP1810: 3V Regulator, 150 mA
U13 = TC1015-1.8VCT713: 1.8V Regulator
U15 = BQ24092: Battery Charger
U19 = IP4234CZ6: USB Line Protection

## Sheet SunBoost.SchDoc
size A3; Organization: Altium Limited; Address1: L3, 12a Rodborough Rd; Address2: Frenchs Forest; Address3: NSW; Address4: Australia 2086
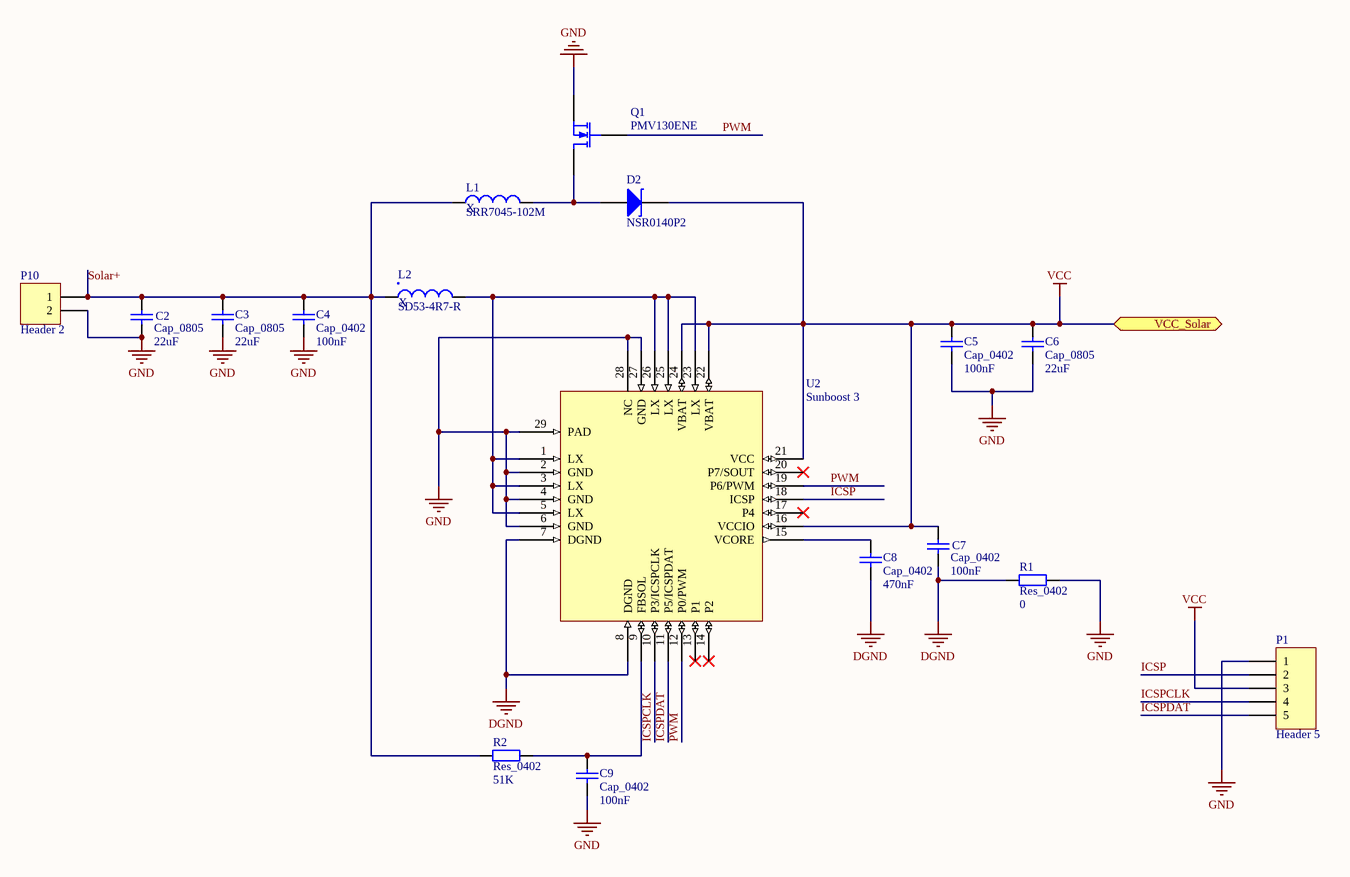
[diagram p4: SunBoost.SchDoc]

### Parts
(Parts that share a designator on the sheet are numbered #1, #2 ... from top to bottom, then left to right.)
C2  Cap_0805  value 22uF  [0805]
C3  Cap_0805  value 22uF  [0805]
C4  Cap_0402  value 100nF  [0402]
C5  Cap_0402  value 100nF  [0402]
C6  Cap_0805  value 22uF  [0805]
C7  Cap_0402  value 100nF  [0402]
C8  Cap_0402  value 470nF  [0402]
C9  Cap_0402  value 100nF  [0402]
D2  NSR0140P2  [SOD-923]
L1  SRR7045-102M  value X  [SRR7045-102M]
L2  SD53-4R7-R  value X  [SD53-4R7-R]
P1#2  Header 5  [HDR1X5]
P10  Header 2  [HDR1X2]
Q1  PMV130ENE  [SOT-23]
R1  Res_0402  value 0  [0402]
R2  Res_0402  value 51K  [0402]
U2  Sunboost 3  [28-QFN_0.4mm]

### Ports
VCC_Solar (bidir)

### Nets
DGND: C7.1 C8.1 R1.1 U2.7(DGND) U2.8(DGND)
GND: C2.1 C3.1 C4.1 C5.1 C6.1 C9.1 P1#2.1 P10.2 Q1.2(S) R1.2 U2.2(GND) U2.4(GND) U2.6(GND) U2.27(GND) U2.28(NC) U2.29(PAD)
VCC: C5.2 C6.2 C7.2 D2.1(K) P1#2.3 U2.16(VCCIO) U2.21(VCC) U2.22(VBAT) U2.24(VBAT) ; port VCC_Solar
ICSP: P1#2.2 U2.18(ICSP)
ICSPCLK: P1#2.4 U2.10(P3/ICSPCLK)
ICSPDAT: P1#2.5 U2.11(P5/ICSPDAT)
PWM: Q1.1(G) U2.12(P0/PWM) U2.19(P6/PWM)
Solar+: C2.2 C3.2 C4.2 L1.1 L2.1 P10.1 R2.1
NetC8_2: C8.2 U2.15(VCORE)
NetC9_2: C9.2 R2.2 U2.9(FBSOL)
NetD2_2: D2.2(A) L1.2 Q1.3(D)
NetL2_2: L2.2 U2.1(LX) U2.3(LX) U2.5(LX) U2.23(LX) U2.25(LX) U2.26(LX)

Not connected (* = marked no-connect by the designer): U2 13(P1)* 14(P2)* 17(P4)* 20(P7/SOUT)*

### Notes on the sheet
- Title
- Size:
- Date:
- A3
- Number:
- Time:
- Revision:
- Sheet
- of
- File:

### Library data of the parts
C2 C3 C6 = Cap_0805: Capacitor; Published: 8-Jun-2000; LatestRevisionDate: 17-Jul-2002; LatestRevisionNote: Re-released for DXP Platform.; PackageReference: RAD-0.3; Publisher: Altium Limited; PackageDescription: Radial Cap, Thru-Hole; 2 Leads; 0.3 in Pin Spacing
C4 C5 C7-C9 = Cap_0402: Capacitor; Published: 8-Jun-2000; LatestRevisionDate: 17-Jul-2002; LatestRevisionNote: Re-released for DXP Platform.; PackageReference: RAD-0.3; Publisher: Altium Limited; PackageDescription: Radial Cap, Thru-Hole; 2 Leads; 0.3 in Pin Spacing
D2 = NSR0140P2: Typical INFRARED GaAs LED; Published: 8-Jun-2000; LatestRevisionDate: 08-Jul-2005; LatestRevisionNote: Mech Layer 1 removed.; PackageReference: LED-0; Publisher: Altium Limited; PackageDescription: LED; 2 Leads
L1 = SRR7045-102M: Inductor
L2 = SD53-4R7-R: Inductor
P1#2 = Header 5: Header, 5-Pin; LatestRevisionDate: 17-Jul-2002; LatestRevisionNote: Re-released for DXP Platform.; Publisher: Altium Limited
P10 = Header 2: Header, 2-Pin; LatestRevisionDate: 17-Jul-2002; LatestRevisionNote: Re-released for DXP Platform.; Publisher: Altium Limited
Q1 = PMV130ENE: N-Channel MOSFET; Published: 8-Jun-2000; LatestRevisionDate: 17-Jul-2002; LatestRevisionNote: Re-released for DXP Platform.; PackageVersion: 1995/1996; PackageReference: E3; Publisher: Altium Limited; PackageDescription: TO, Flat Index; 3 In-Line, Axial Leads; Body Dia. 4.6mm; Lead Dia. 0.5 mm (max)
R1 R2 = Res_0402: Resistor; Published: 8-Jun-2000; LatestRevisionDate: 17-Jul-2002; LatestRevisionNote: Re-released for DXP Platform.; PackageReference: AXIAL-0.4; Publisher: Altium Limited; PackageDescription: Axial Device, Thru-Hole; 2 Leads; 0.4 in Pin Spacing
U2 = Sunboost 3: Initvation Sunboost 3

## Sheet 4G.SchDoc
size A3; Organization: Altium Limited; Address1: L3, 12a Rodborough Rd; Address2: Frenchs Forest; Address3: NSW; Address4: Australia 2086
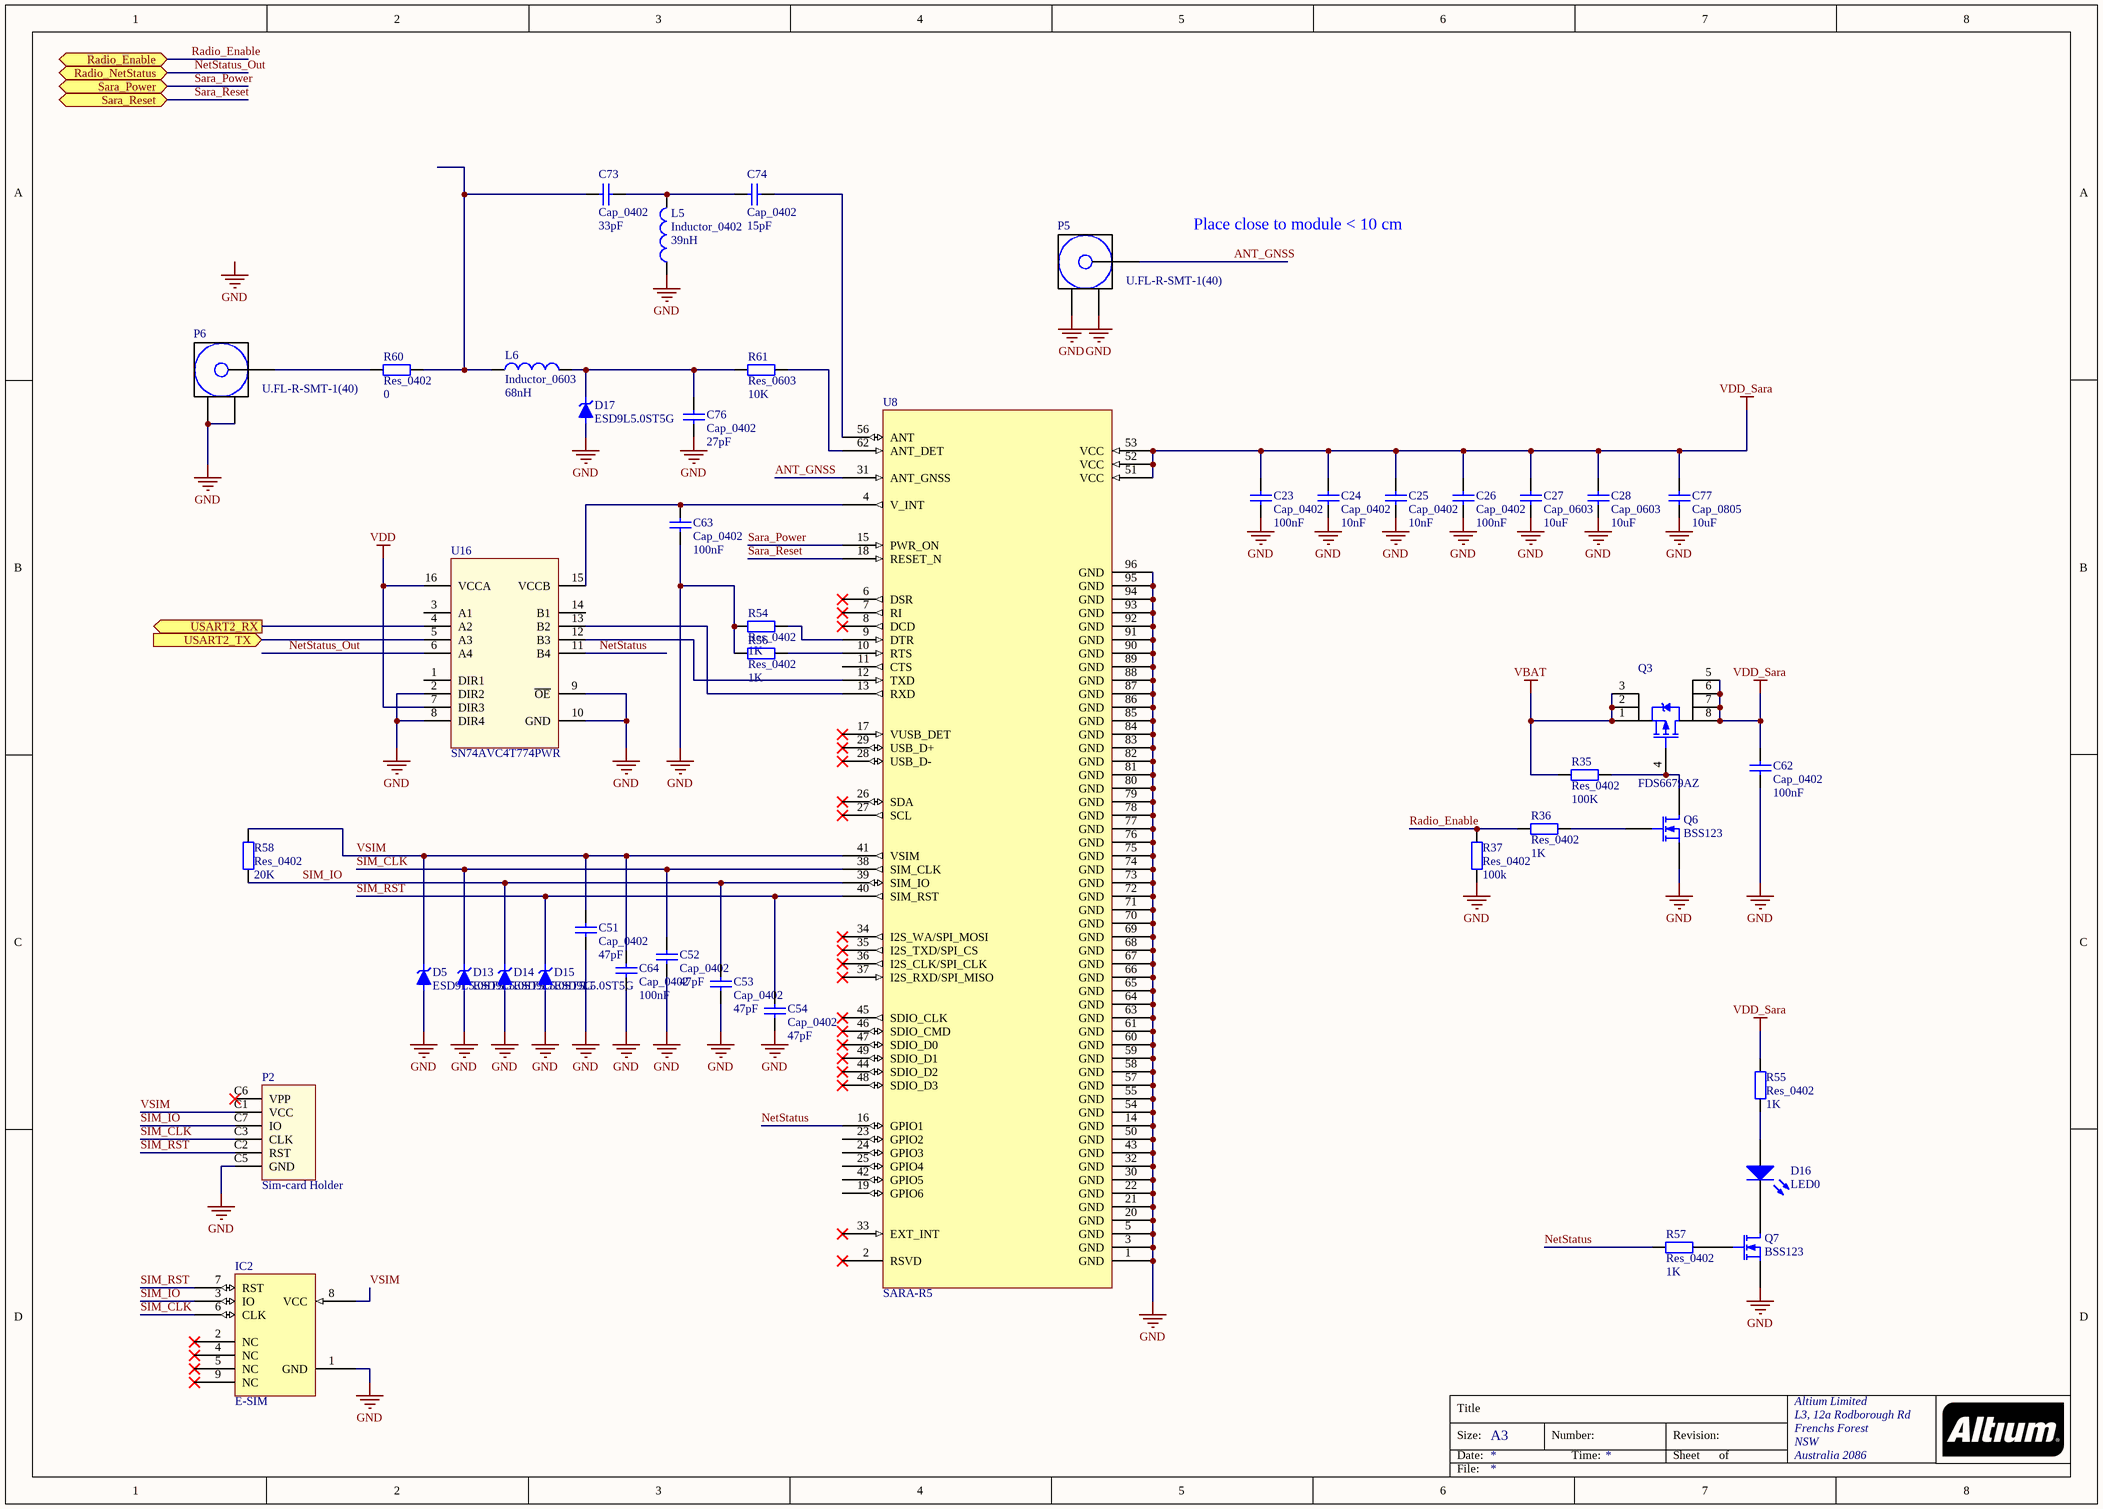
[diagram p5: 4G.SchDoc]

### Parts
C23  Cap_0402  value 100nF  [0402]
C24  Cap_0402  value 10nF  [0402]
C25  Cap_0402  value 10nF  [0402]
C26  Cap_0402  value 100nF  [0402]
C27  Cap_0603  value 10uF  [0603]
C28  Cap_0603  value 10uF  [0603]
C51  Cap_0402  value 47pF  [0402]
C52  Cap_0402  value 47pF  [0402]
C53  Cap_0402  value 47pF  [0402]
C54  Cap_0402  value 47pF  [0402]
C62  Cap_0402  value 100nF  [0402]
C63  Cap_0402  value 100nF  [0402]
C64  Cap_0402  value 100nF  [0402]
C73  Cap_0402  value 33pF  [0402]
C74  Cap_0402  value 15pF  [0402]
C76  Cap_0402  value 27pF  [0402]
C77  Cap_0805  value 10uF  [0805]
D5  ESD9L5.0ST5G  [SODFL100X40-2N]
D13  ESD9L5.0ST5G  [SODFL100X40-2N]
D14  ESD9L5.0ST5G  [SODFL100X40-2N]
D15  ESD9L5.0ST5G  [SODFL100X40-2N]
D16  LED0  [0603]
D17  ESD9L5.0ST5G  [SODFL100X40-2N]
IC2  E-SIM  [MFF2-ESIM]
L5  Inductor_0402  value 39nH  [0402]
L6  Inductor_0603  value 68nH  [0603]
P2  Sim-card Holder  [Sim-card Holder]
P5  U.FL-R-SMT-1(40)  [U.FL-R-SMT-1(40)]
P6  U.FL-R-SMT-1(40)  [U.FL-R-SMT-1(40)]
Q3  FDS6679AZ  [SOIC127P600X175-8N]
Q6  BSS123  [SOT-23]
Q7  BSS123  [SOT-23]
R35  Res_0402  value 100K  [0402]
R36  Res_0402  value 1K  [0402]
R37  Res_0402  value 100k  [0402]
R54  Res_0402  value 1K  [0402]
R55  Res_0402  value 1K  [0402]
R56  Res_0402  value 1K  [0402]
R57  Res_0402  value 1K  [0402]
R58  Res_0402  value 20K  [0402]
R60  Res_0402  value 0  [0402]
R61  Res_0603  value 10K  [0603]
U8  SARA-R5  [SARA-XX]
U16  SN74AVC4T774PWR  [TSOP65P640X120-16N]

### Ports
Radio_Enable (bidir), Radio_NetStatus (bidir), Sara_Power (bidir), Sara_Reset (bidir), USART2_RX (out), USART2_TX (in)

### Nets
GND: C23.1 C24.1 C25.1 C26.1 C27.1 C28.1 C51.1 C52.1 C53.1 C54.1 C62.1 C63.1 C64.1 C76.1 C77.1 D5.2 D13.2 D14.2 D15.2 D17.2 IC2.1(GND) L5.1 P2.C5(GND) P5.2 P5.3 P6.2 P6.3 Q6.2(S) Q7.2(S) R37.1 R54.1 R56.1 U8.1(GND) U8.3(GND) U8.5(GND) U8.14(GND) U8.20(GND) U8.21(GND) U8.22(GND) U8.30(GND) U8.32(GND) U8.43(GND) U8.50(GND) U8.54(GND) U8.55(GND) U8.57(GND) U8.58(GND) U8.59(GND) U8.60(GND) U8.61(GND) U8.63(GND) U8.64(GND) U8.65(GND) U8.66(GND) U8.67(GND) U8.68(GND) U8.69(GND) U8.70(GND) U8.71(GND) U8.72(GND) U8.73(GND) U8.74(GND) U8.75(GND) U8.76(GND) U8.77(GND) U8.78(GND) U8.79(GND) U8.80(GND) U8.81(GND) U8.82(GND) U8.83(GND) U8.84(GND) U8.85(GND) U8.86(GND) U8.87(GND) U8.88(GND) U8.89(GND) U8.90(GND) U8.91(GND) U8.92(GND) U8.93(GND) U8.94(GND) U8.95(GND) U8.96(GND) U16.2(DIR2) U16.8(DIR4) U16.9(~{OE}) U16.10(GND)
VBAT: Q3.1(S) Q3.2(S) Q3.3(S) R35.1
VDD: U16.7(DIR3) U16.16(VCCA)
VDD_Sara: C23.2 C24.2 C25.2 C26.2 C27.2 C28.2 C62.2 C77.2 Q3.5(D) Q3.6(D) Q3.7(D) Q3.8(D) R55.2 U8.51(VCC) U8.52(VCC) U8.53(VCC)
ANT_GNSS: P5.1 U8.31(ANT_GNSS)
NetStatus: R57.1 U8.16(GPIO1) U16.11(B4)
NetStatus_Out: U16.6(A4) ; port Radio_NetStatus
Radio_Enable: R36.1 R37.2 ; port Radio_Enable  [project net Radio Enable]
Sara_Power: U8.15(PWR_ON) ; port Sara_Power
Sara_Reset: U8.18(RESET_N) ; port Sara_Reset
SIM_CLK: C52.2 D13.1 IC2.6(CLK) P2.C3(CLK) U8.38(SIM_CLK)
SIM_IO: C53.2 D14.1 IC2.3(IO) P2.C7(IO) R58.1 U8.39(SIM_IO)
SIM_RST: C54.2 D15.1 IC2.7(RST) P2.C2(RST) U8.40(SIM_RST)
USART2_RX: U16.4(A2) ; port USART2_RX
USART2_TX: U16.5(A3) ; port USART2_TX
VSIM: C51.2 C64.2 D5.1 IC2.8(VCC) P2.C1(VCC) R58.2 U8.41(VSIM)
NetC63_2: C63.2 U8.4(V_INT) U16.15(VCCB)
NetC73_1: C73.1 C74.1 L5.2
NetC73_2: C73.2 L6.1 R60.2
NetC74_2: C74.2 U8.56(ANT)
NetC76_2: C76.2 D17.1 L6.2 R61.1
NetD16_1: D16.1(K) Q7.3(D)
NetD16_2: D16.2(A) R55.1
NetP6_1: P6.1 R60.1
NetQ3_4: Q3.4(G) Q6.3(D) R35.2
NetQ6_1: Q6.1(G) R36.2
NetQ7_1: Q7.1(G) R57.2
NetR54_2: R54.2 U8.9(DTR)
NetR56_2: R56.2 U8.10(RTS)
NetR61_2: R61.2 U8.62(ANT_DET)
NetU8_12: U8.12(TXD) U16.12(B3)
NetU8_13: U8.13(RXD) U16.13(B2)

Not connected (* = marked no-connect by the designer): IC2 2(NC)* 4(NC)* 5(NC)* 9(NC)*; P2 C6(VPP)*; U8 2(RSVD)* 6(DSR)* 7(RI)* 8(DCD)* 11(CTS) 17(VUSB_DET)* 19(GPIO6) 23(GPIO2) 24(GPIO3) 25(GPIO4) 26(SDA)* 27(SCL)* 28(USB_D-)* 29(USB_D+)* 33(EXT_INT)* 34(I2S_WA/SPI_MOSI)* 35(I2S_TXD/SPI_CS)* 36(I2S_CLK/SPI_CLK)* 37(I2S_RXD/SPI_MISO)* 42(GPIO5) 44(SDIO_D2)* 45(SDIO_CLK)* 46(SDIO_CMD)* 47(SDIO_D0)* 48(SDIO_D3)* 49(SDIO_D1)*; U16 1(DIR1) 3(A1) 14(B1)

### Notes on the sheet
- Place close to module < 10 cm
- Labels drawn without touching a wire or pin: GND
- Title
- Size:
- Date:
- A3
- Number:
- Time:
- Revision:
- Sheet
- of
- File:

### Library data of the parts
C23-C26 C51-C54 C62-C64 C73 C74 C76 = Cap_0402: Capacitor; Published: 8-Jun-2000; LatestRevisionDate: 17-Jul-2002; LatestRevisionNote: Re-released for DXP Platform.; PackageReference: RAD-0.3; Publisher: Altium Limited; PackageDescription: Radial Cap, Thru-Hole; 2 Leads; 0.3 in Pin Spacing
C27 C28 = Cap_0603: Capacitor; Published: 8-Jun-2000; LatestRevisionDate: 17-Jul-2002; LatestRevisionNote: Re-released for DXP Platform.; PackageReference: RAD-0.3; Publisher: Altium Limited; PackageDescription: Radial Cap, Thru-Hole; 2 Leads; 0.3 in Pin Spacing
C77 = Cap_0805: Capacitor; Published: 8-Jun-2000; LatestRevisionDate: 17-Jul-2002; LatestRevisionNote: Re-released for DXP Platform.; PackageReference: RAD-0.3; Publisher: Altium Limited; PackageDescription: Radial Cap, Thru-Hole; 2 Leads; 0.3 in Pin Spacing
D5 D13-D15 D17 = ESD9L5-0ST5G: TVS_ESD9L5-0ST5G
D16 = LED0: Typical INFRARED GaAs LED; Published: 8-Jun-2000; LatestRevisionDate: 08-Jul-2005; LatestRevisionNote: Mech Layer 1 removed.; PackageReference: LED-0; Publisher: Altium Limited; PackageDescription: LED; 2 Leads
L5 = Inductor_0402: Inductor
L6 = Inductor_0603: Inductor
P2 = Sim-card Holder: 788000001_Molex
P5 P6 = RF-Connector
Q3 = FDS6679AZ: Transistor, FET
Q6 Q7 = BSS123: N-Channel MOSFET; Published: 8-Jun-2000; LatestRevisionDate: 17-Jul-2002; LatestRevisionNote: Re-released for DXP Platform.; PackageVersion: 1995/1996; PackageReference: E3; Publisher: Altium Limited; PackageDescription: TO, Flat Index; 3 In-Line, Axial Leads; Body Dia. 4.6mm; Lead Dia. 0.5 mm (max)
R35-R37 R54-R58 R60 = Res_0402: Resistor; Published: 8-Jun-2000; LatestRevisionDate: 17-Jul-2002; LatestRevisionNote: Re-released for DXP Platform.; PackageReference: AXIAL-0.4; Publisher: Altium Limited; PackageDescription: Axial Device, Thru-Hole; 2 Leads; 0.4 in Pin Spacing
R61 = Res_0603: Resistor; Published: 8-Jun-2000; LatestRevisionDate: 17-Jul-2002; LatestRevisionNote: Re-released for DXP Platform.; PackageReference: AXIAL-0.4; Publisher: Altium Limited; PackageDescription: Axial Device, Thru-Hole; 2 Leads; 0.4 in Pin Spacing
U16 = SN74AVC4T774PWR: Buffer

## Sheet UI.SchDoc
size A3; Organization: Altium Limited; Address1: L3, 12a Rodborough Rd; Address2: Frenchs Forest; Address3: NSW; Address4: Australia 2086
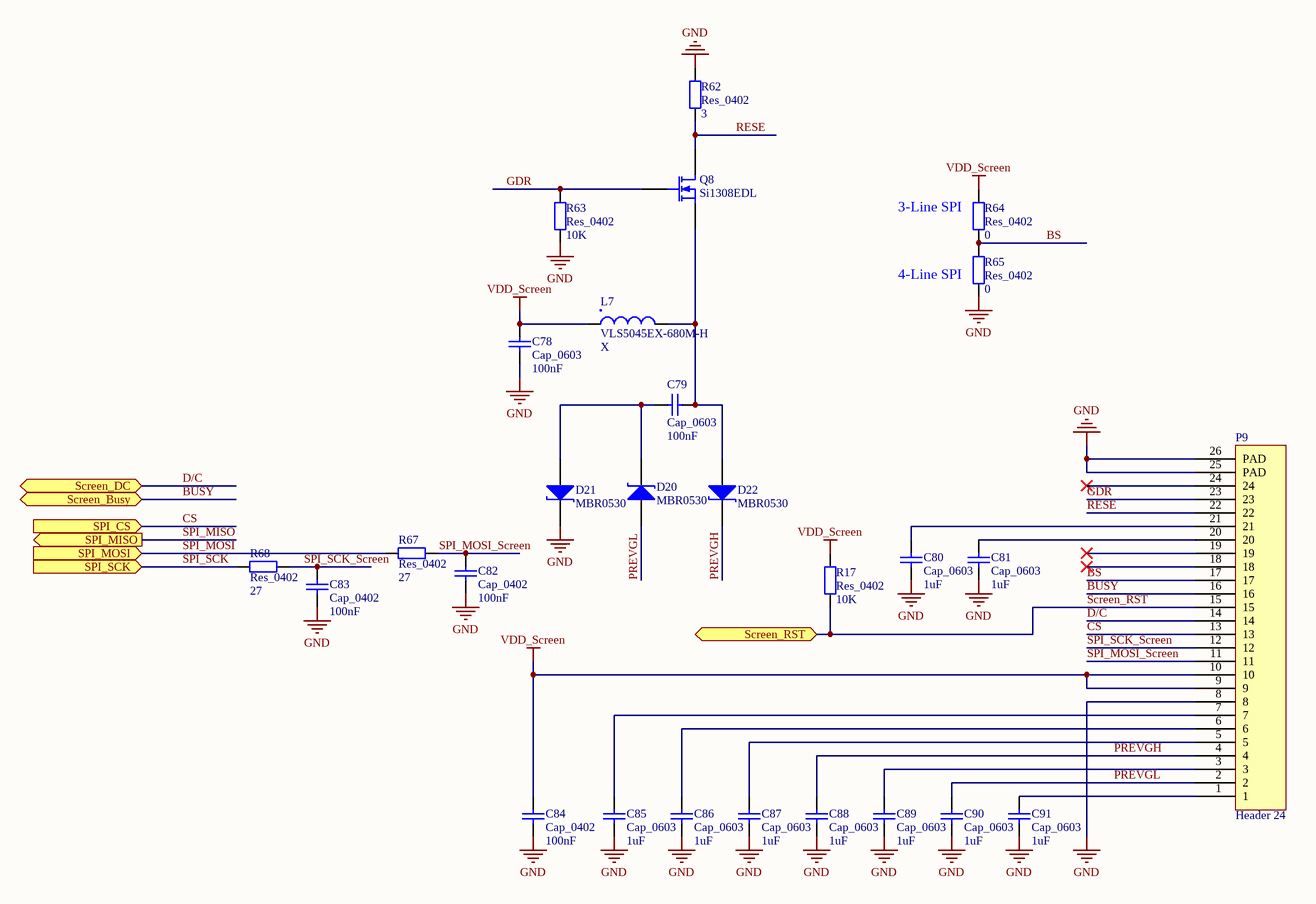
[diagram p6: UI.SchDoc]

### Parts
C78  Cap_0603  value 100nF  [0603]
C79  Cap_0603  value 100nF  [0603]
C80  Cap_0603  value 1uF  [0603]
C81  Cap_0603  value 1uF  [0603]
C82  Cap_0402  value 100nF  [0402]
C83  Cap_0402  value 100nF  [0402]
C84  Cap_0402  value 100nF  [0402]
C85  Cap_0603  value 1uF  [0603]
C86  Cap_0603  value 1uF  [0603]
C87  Cap_0603  value 1uF  [0603]
C88  Cap_0603  value 1uF  [0603]
C89  Cap_0603  value 1uF  [0603]
C90  Cap_0603  value 1uF  [0603]
C91  Cap_0603  value 1uF  [0603]
D20  MBR0530  [SOD-123]
D21  MBR0530  [SOD-123]
D22  MBR0530  [SOD-123]
L7  VLS5045EX-680M-H  value X  [VLS5045EX]
P9  Header 24  [Flex_EInc_Connector]
Q8  Si1308EDL  [SOT-23]
R17  Res_0402  value 10K  [0402]
R62  Res_0402  value 3  [0402]
R63  Res_0402  value 10K  [0402]
R64  Res_0402  value 0  [0402]
R65  Res_0402  value 0  [0402]
R67  Res_0402  value 27  [0402]
R68  Res_0402  value 27  [0402]

### Ports
Screen_Busy (bidir), Screen_DC (bidir), Screen_RST (bidir), SPI_CS (in), SPI_MISO (out), SPI_MOSI (in), SPI_SCK (in)

### Nets
GND: C78.1 C80.1 C81.1 C82.1 C83.1 C84.1 C85.1 C86.1 C87.1 C88.1 C89.1 C90.1 C91.1 D21.1(K) P9.8 P9.25(PAD) P9.26(PAD) R62.2 R63.1 R65.1
VDD_Screen: C78.2 C84.2 L7.1 P9.9 P9.10 R17.2 R64.2
BS: P9.17 R64.1 R65.2
BUSY: P9.16 ; port Screen_Busy
CS: P9.13 ; port SPI_CS
D/C: P9.14 ; port Screen_DC
GDR: P9.23 Q8.1(G) R63.2
PREVGH: C88.2 D22.1(K) P9.4
PREVGL: C90.2 D20.2(A) P9.2
RESE: P9.22 Q8.3(D) R62.1
Screen_RST: P9.15 R17.1 ; port Screen_RST
SPI_MOSI: R67.1 ; port SPI_MOSI
SPI_MOSI_Screen: C82.2 P9.11 R67.2
SPI_SCK: R68.1 ; port SPI_SCK
SPI_SCK_Screen: C83.2 P9.12 R68.2
NetC79_1: C79.1 D20.1(K) D21.2(A)
NetC79_2: C79.2 D22.2(A) L7.2 Q8.2(S)
NetC80_2: C80.2 P9.21
NetC81_2: C81.2 P9.20
NetC85_2: C85.2 P9.7
NetC86_2: C86.2 P9.6
NetC87_2: C87.2 P9.5
NetC89_2: C89.2 P9.3
NetC91_2: C91.2 P9.1

Not connected (* = marked no-connect by the designer): P9 18* 19* 24*

### Notes on the sheet
- (near R64) 3-Line SPI
- (near R65) 4-Line SPI
- Title
- Size:
- Date:
- A3
- Number:
- Time:
- Revision:
- Sheet
- of
- File:

### Library data of the parts
C78-C81 C85-C91 = Cap_0603: Capacitor; Published: 8-Jun-2000; LatestRevisionDate: 17-Jul-2002; LatestRevisionNote: Re-released for DXP Platform.; PackageReference: RAD-0.3; Publisher: Altium Limited; PackageDescription: Radial Cap, Thru-Hole; 2 Leads; 0.3 in Pin Spacing
C82-C84 = Cap_0402: Capacitor; Published: 8-Jun-2000; LatestRevisionDate: 17-Jul-2002; LatestRevisionNote: Re-released for DXP Platform.; PackageReference: RAD-0.3; Publisher: Altium Limited; PackageDescription: Radial Cap, Thru-Hole; 2 Leads; 0.3 in Pin Spacing
D20-D22 = MBR0530: SCHOTTKY BARRIER / RECTIFIER; Published: 8-Jun-2000; LatestRevisionDate: 08-Jul-2005; LatestRevisionNote: Mech Layer 1 removed.; PackageReference: LED-0; Publisher: Altium Limited; PackageDescription: LED; 2 Leads
L7 = VLS5045EX-680M-H: Inductor 68 uH
P9 = Header 24: Header, 24-Pin; LatestRevisionDate: 17-Jul-2002; LatestRevisionNote: Re-released for DXP Platform.; Publisher: Altium Limited
Q8 = Si1308EDL: N-Channel MOSFET; Published: 8-Jun-2000; LatestRevisionDate: 17-Jul-2002; LatestRevisionNote: Re-released for DXP Platform.; PackageVersion: 1995/1996; PackageReference: E3; Publisher: Altium Limited; PackageDescription: TO, Flat Index; 3 In-Line, Axial Leads; Body Dia. 4.6mm; Lead Dia. 0.5 mm (max)
R17 R62-R65 R67 R68 = Res_0402: Resistor; Published: 8-Jun-2000; LatestRevisionDate: 17-Jul-2002; LatestRevisionNote: Re-released for DXP Platform.; PackageReference: AXIAL-0.4; Publisher: Altium Limited; PackageDescription: Axial Device, Thru-Hole; 2 Leads; 0.4 in Pin Spacing

## Nets that join several sheets
Accelerometer_Enable: MCU (U1.28), Sensors (9 pins)
GND: MCU (46 pins), Sensors (26 pins), Power (53 pins), SunBoost (16 pins), 4G (88 pins), UI (20 pins)
VBAT: Sensors (R3.2 R5.1 R6.2), Power (15 pins), 4G (Q3.1 Q3.2 Q3.3 R35.1)
VCC: Sensors (R4.2 R5.2), SunBoost (9 pins)
VDD: MCU (18 pins), Power (C36.2 R7.2 U10.2 U10.6), 4G (U16.7 U16.16)
VDD_Screen: Power (C92.2 U9.5), UI (7 pins)
VDD_SD: MCU (7 pins), Power (C49.2 U14.2 U14.6)
VDD_Sensor: Sensors (10 pins), Power (C38.2 U11.2 U11.6)
VDD_Spectrum: Sensors (6 pins), Power (C57.2 U13.5)
BUSY: MCU (U1.41), UI (P9.16)
CS: MCU (U1.33), UI (P9.13)
D/C: MCU (U1.37), UI (P9.14)
I2C1_SCL: MCU (U1.61), Sensors (R30.1 U7.2)
I2C1_SDA: MCU (U1.62), Sensors (R29.1 U7.8)
I2C2_SCL: MCU (U1.29), Sensors (R33.1 U6.1)
I2C2_SDA: MCU (U1.30), Sensors (R34.1 U6.4)
I2C4_SCL: MCU (U1.58), Sensors (5 pins)
I2C4_SDA: MCU (U1.59), Sensors (5 pins)
NetR22_1: MCU (U1.44), Power (R22.1)
NetR23_1: MCU (U1.45), Power (R23.1)
NetStatus_Out: MCU (U1.15), 4G (U16.6)
Radio Enable: MCU (U1.20), 4G (R36.1 R37.2)
Sara_Power: MCU (Q5.3), 4G (U8.15)
Sara_Reset: MCU (Q4.3), 4G (U8.18)
Screen_Enable: MCU (U1.27), Power (R66.1 U9.3)
Screen_RST: MCU (U1.38), UI (P9.15 R17.1)
SD_Enable: MCU (U1.50), Power (R16.2 U14.8)
Sensor_Enable: MCU (U1.57), Power (R14.1 U11.8)
Spectrum_Enable: MCU (U1.2), Power (R40.1 U13.3)
SPI_MOSI: MCU (U1.36), UI (R67.1)
SPI_SCK: MCU (U1.34), UI (R68.1)
USART2_RX: MCU (U1.17), 4G (U16.4)
USART2_TX: MCU (U1.16), 4G (U16.5)
USB_Detect: MCU (U1.56), Power (C55.2 R38.1 R39.2)